# EAGLE schematic 20200724_Main_Board_V2_ForOrdering (EAGLE 7.7.0), part 1 of 2
DATABASE: ./BOM/PartsDB.txt
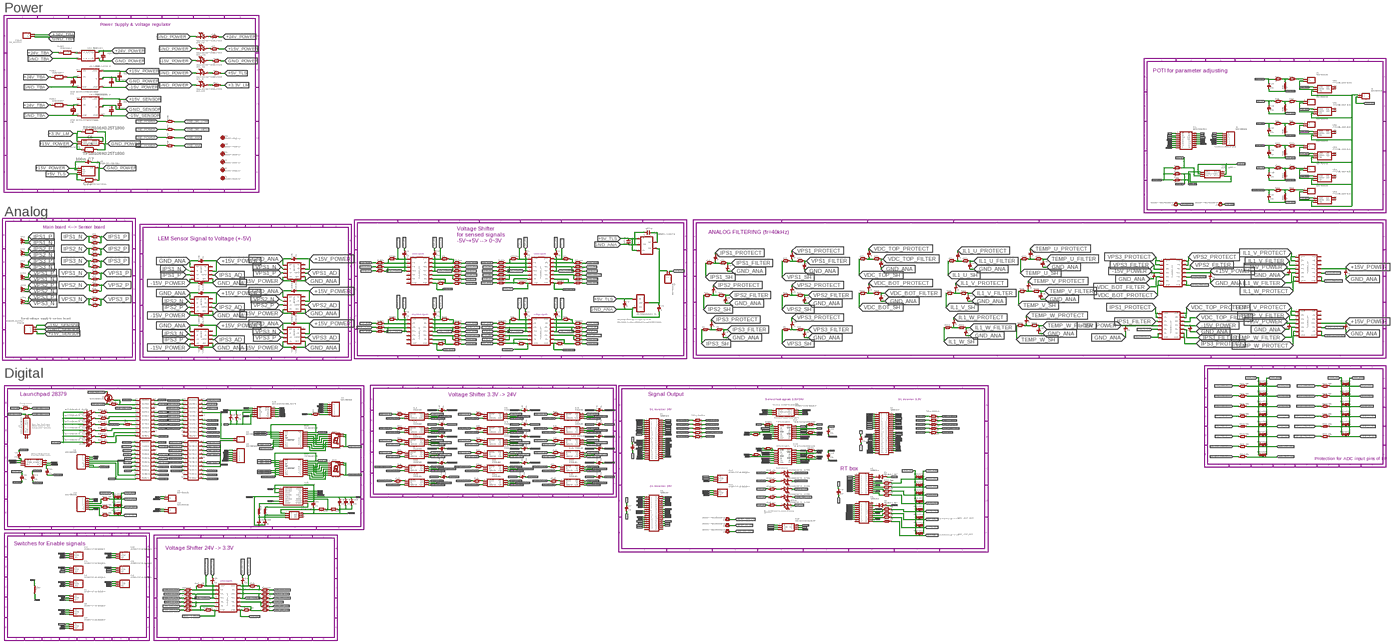
[diagram p0: schematic, sheet 1, overview]
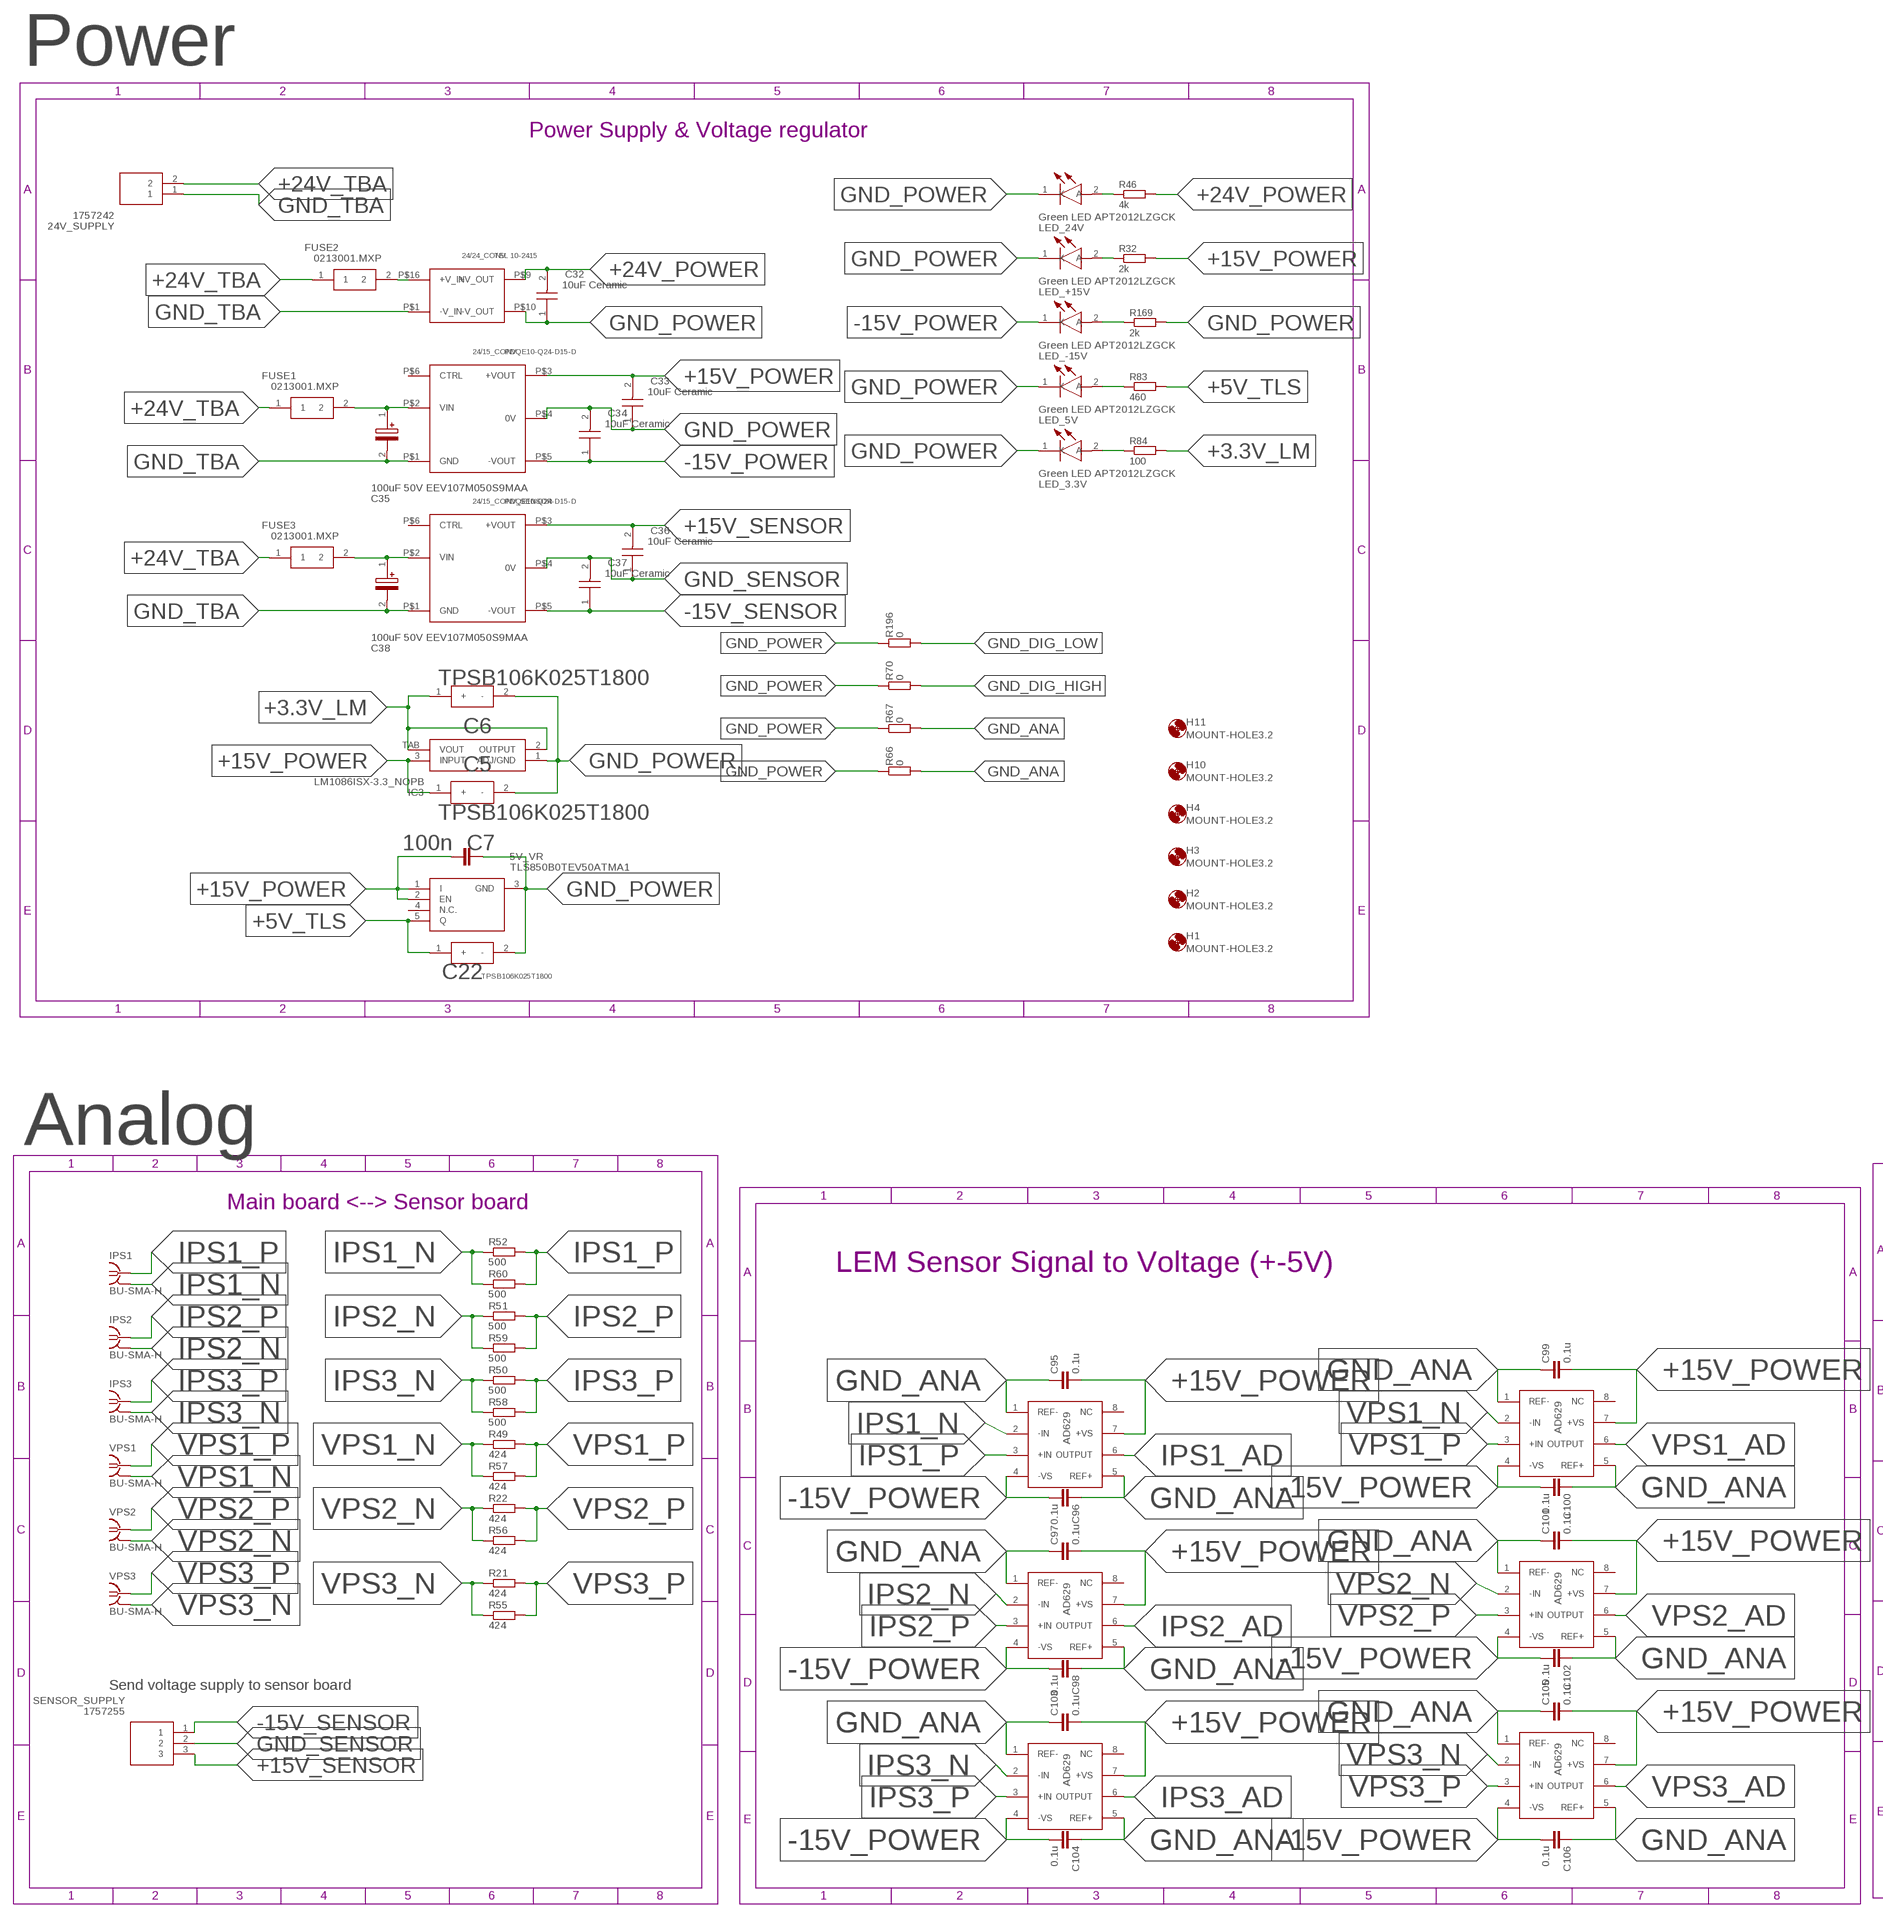
[diagram p1: schematic, sheet 1, part 1 of 9]
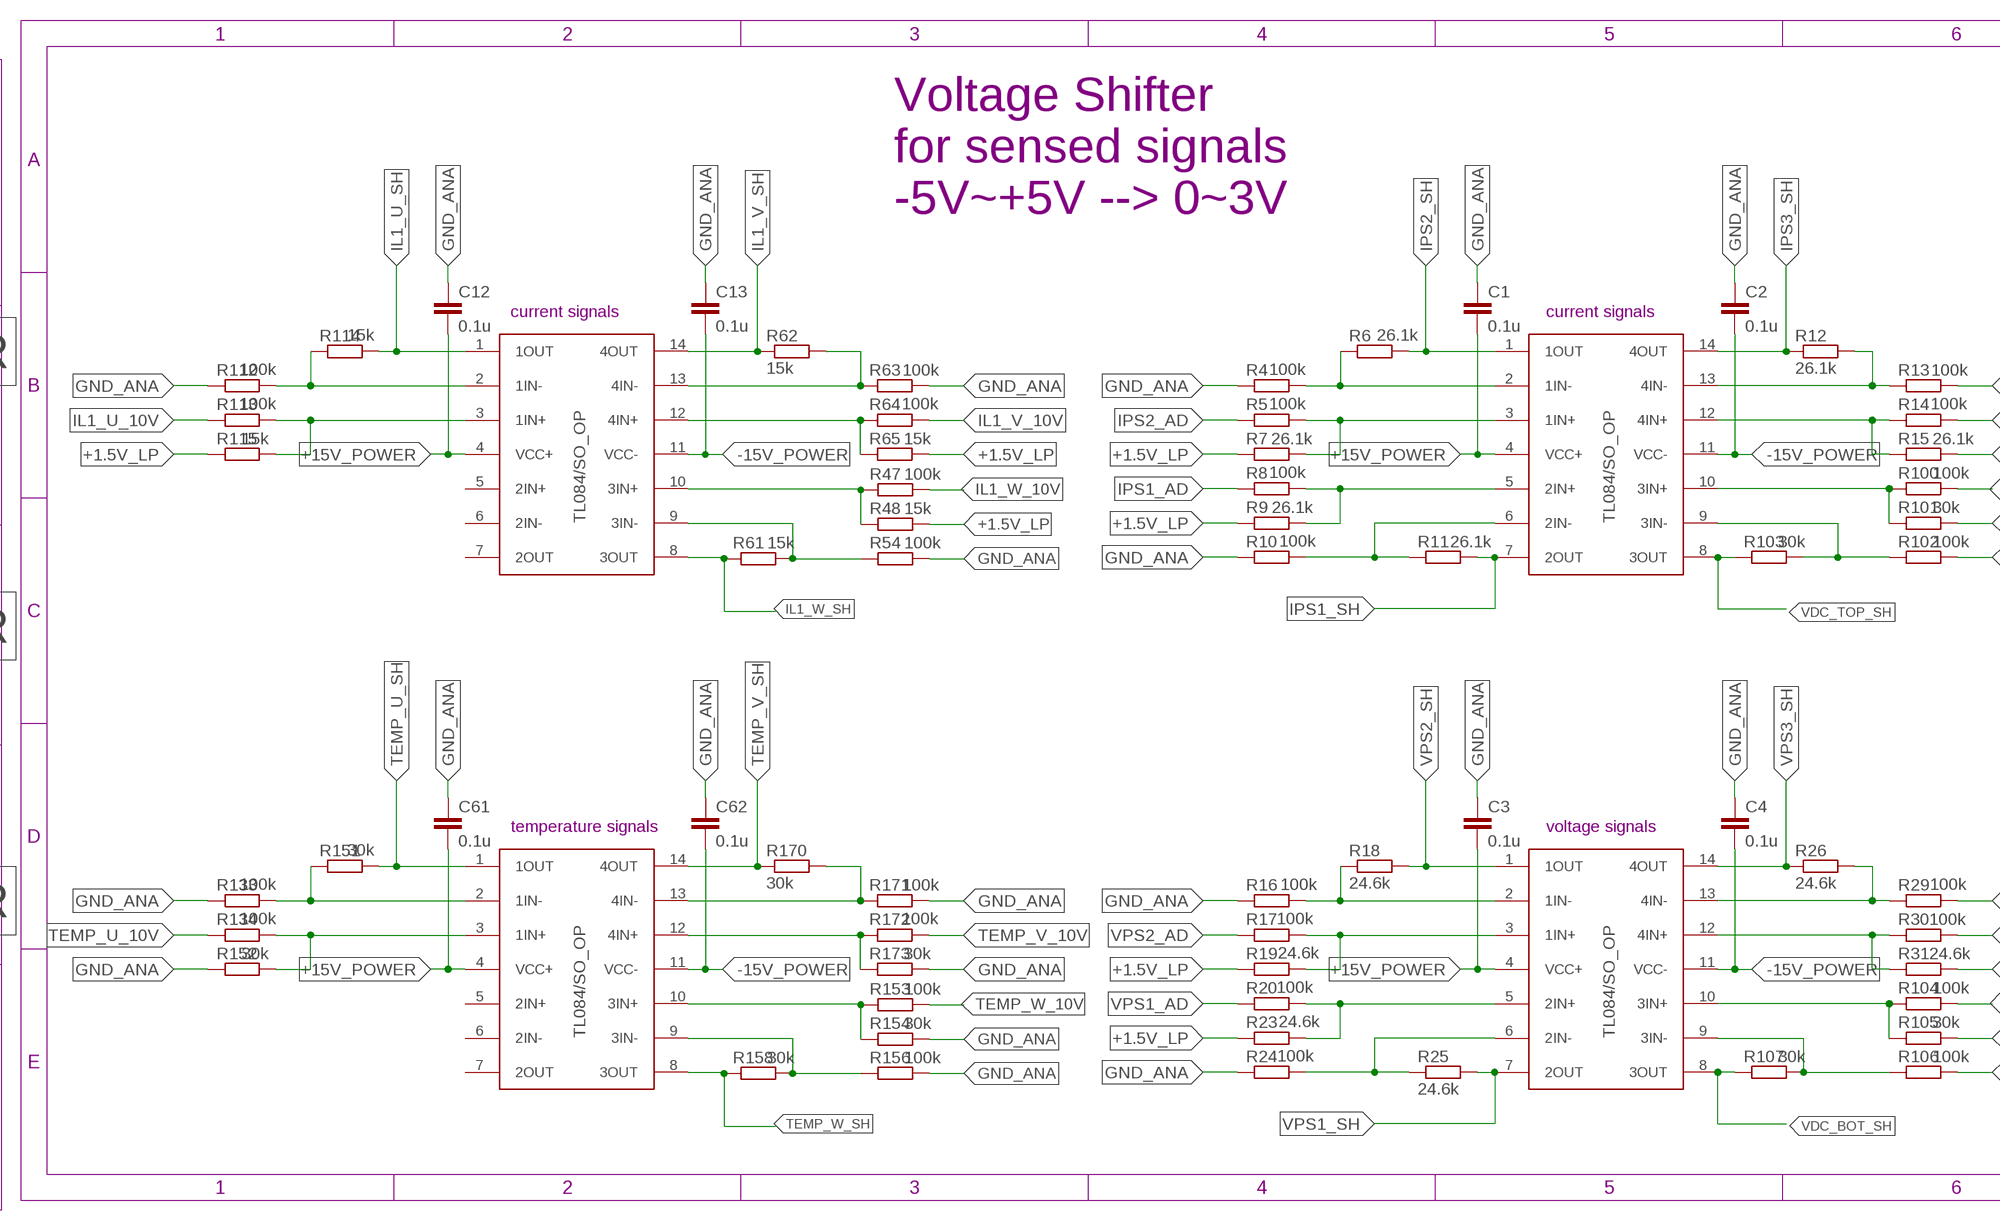
[diagram p2: schematic, sheet 1, part 2 of 9]
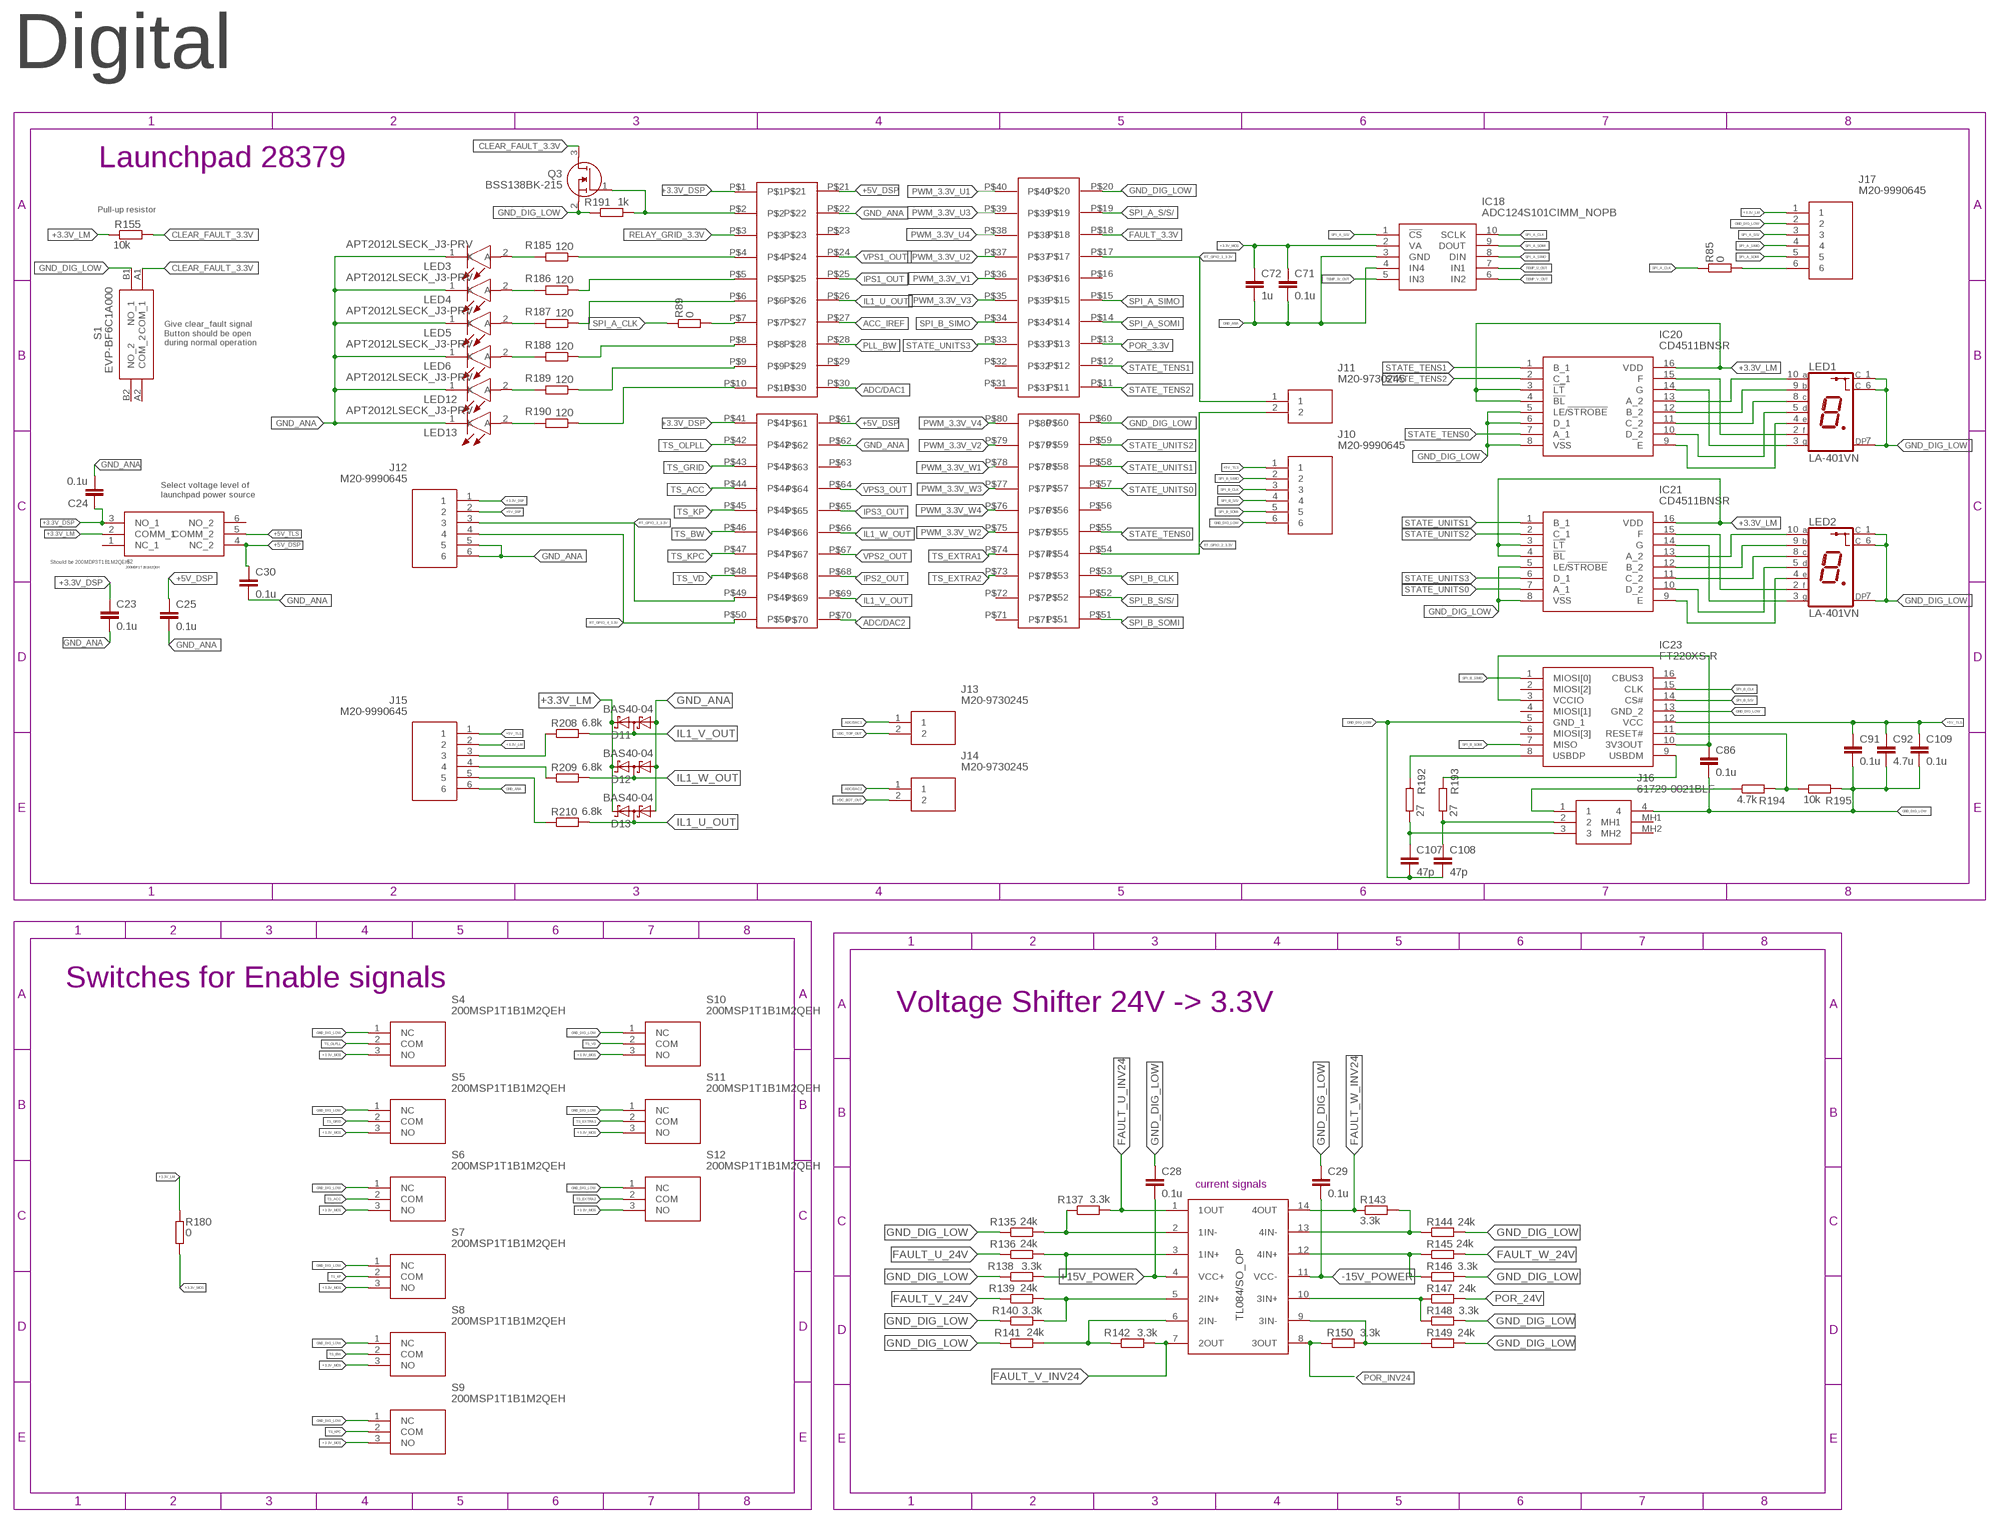
[diagram p3: schematic, sheet 1, part 3 of 9]
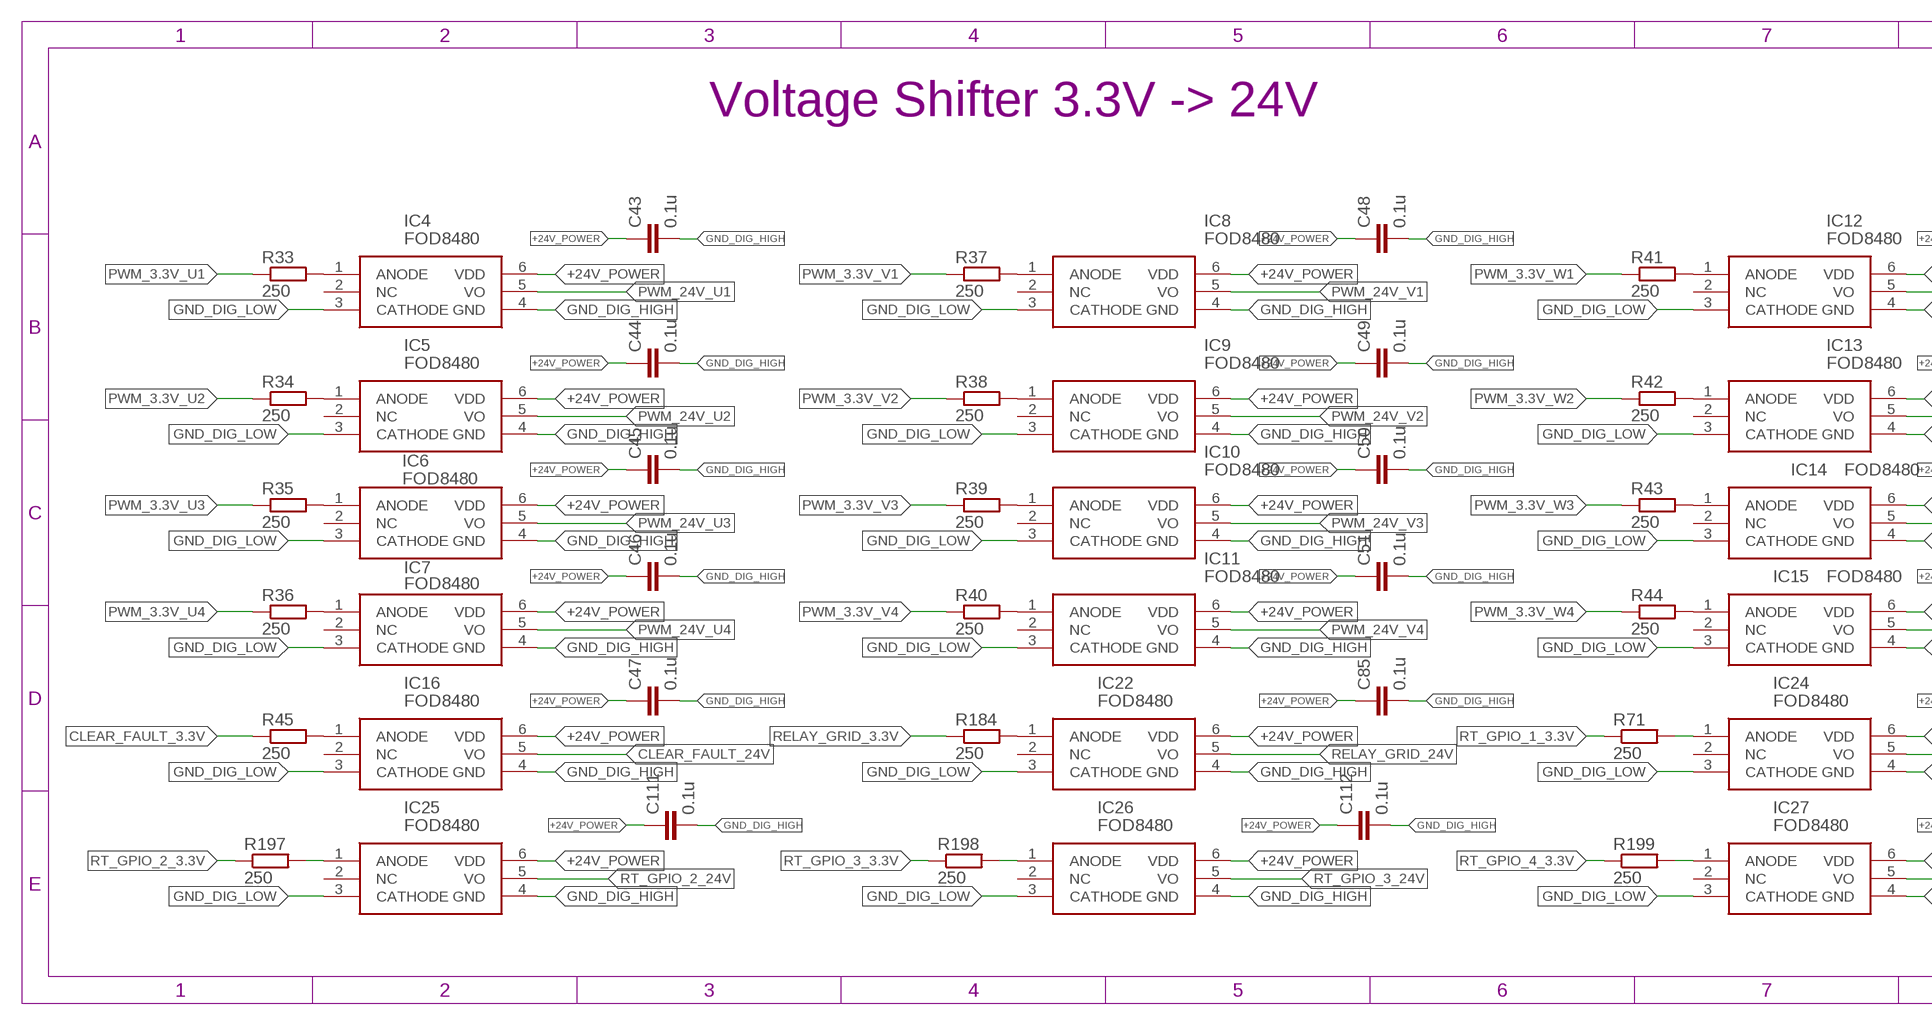
[diagram p4: schematic, sheet 1, part 4 of 9]
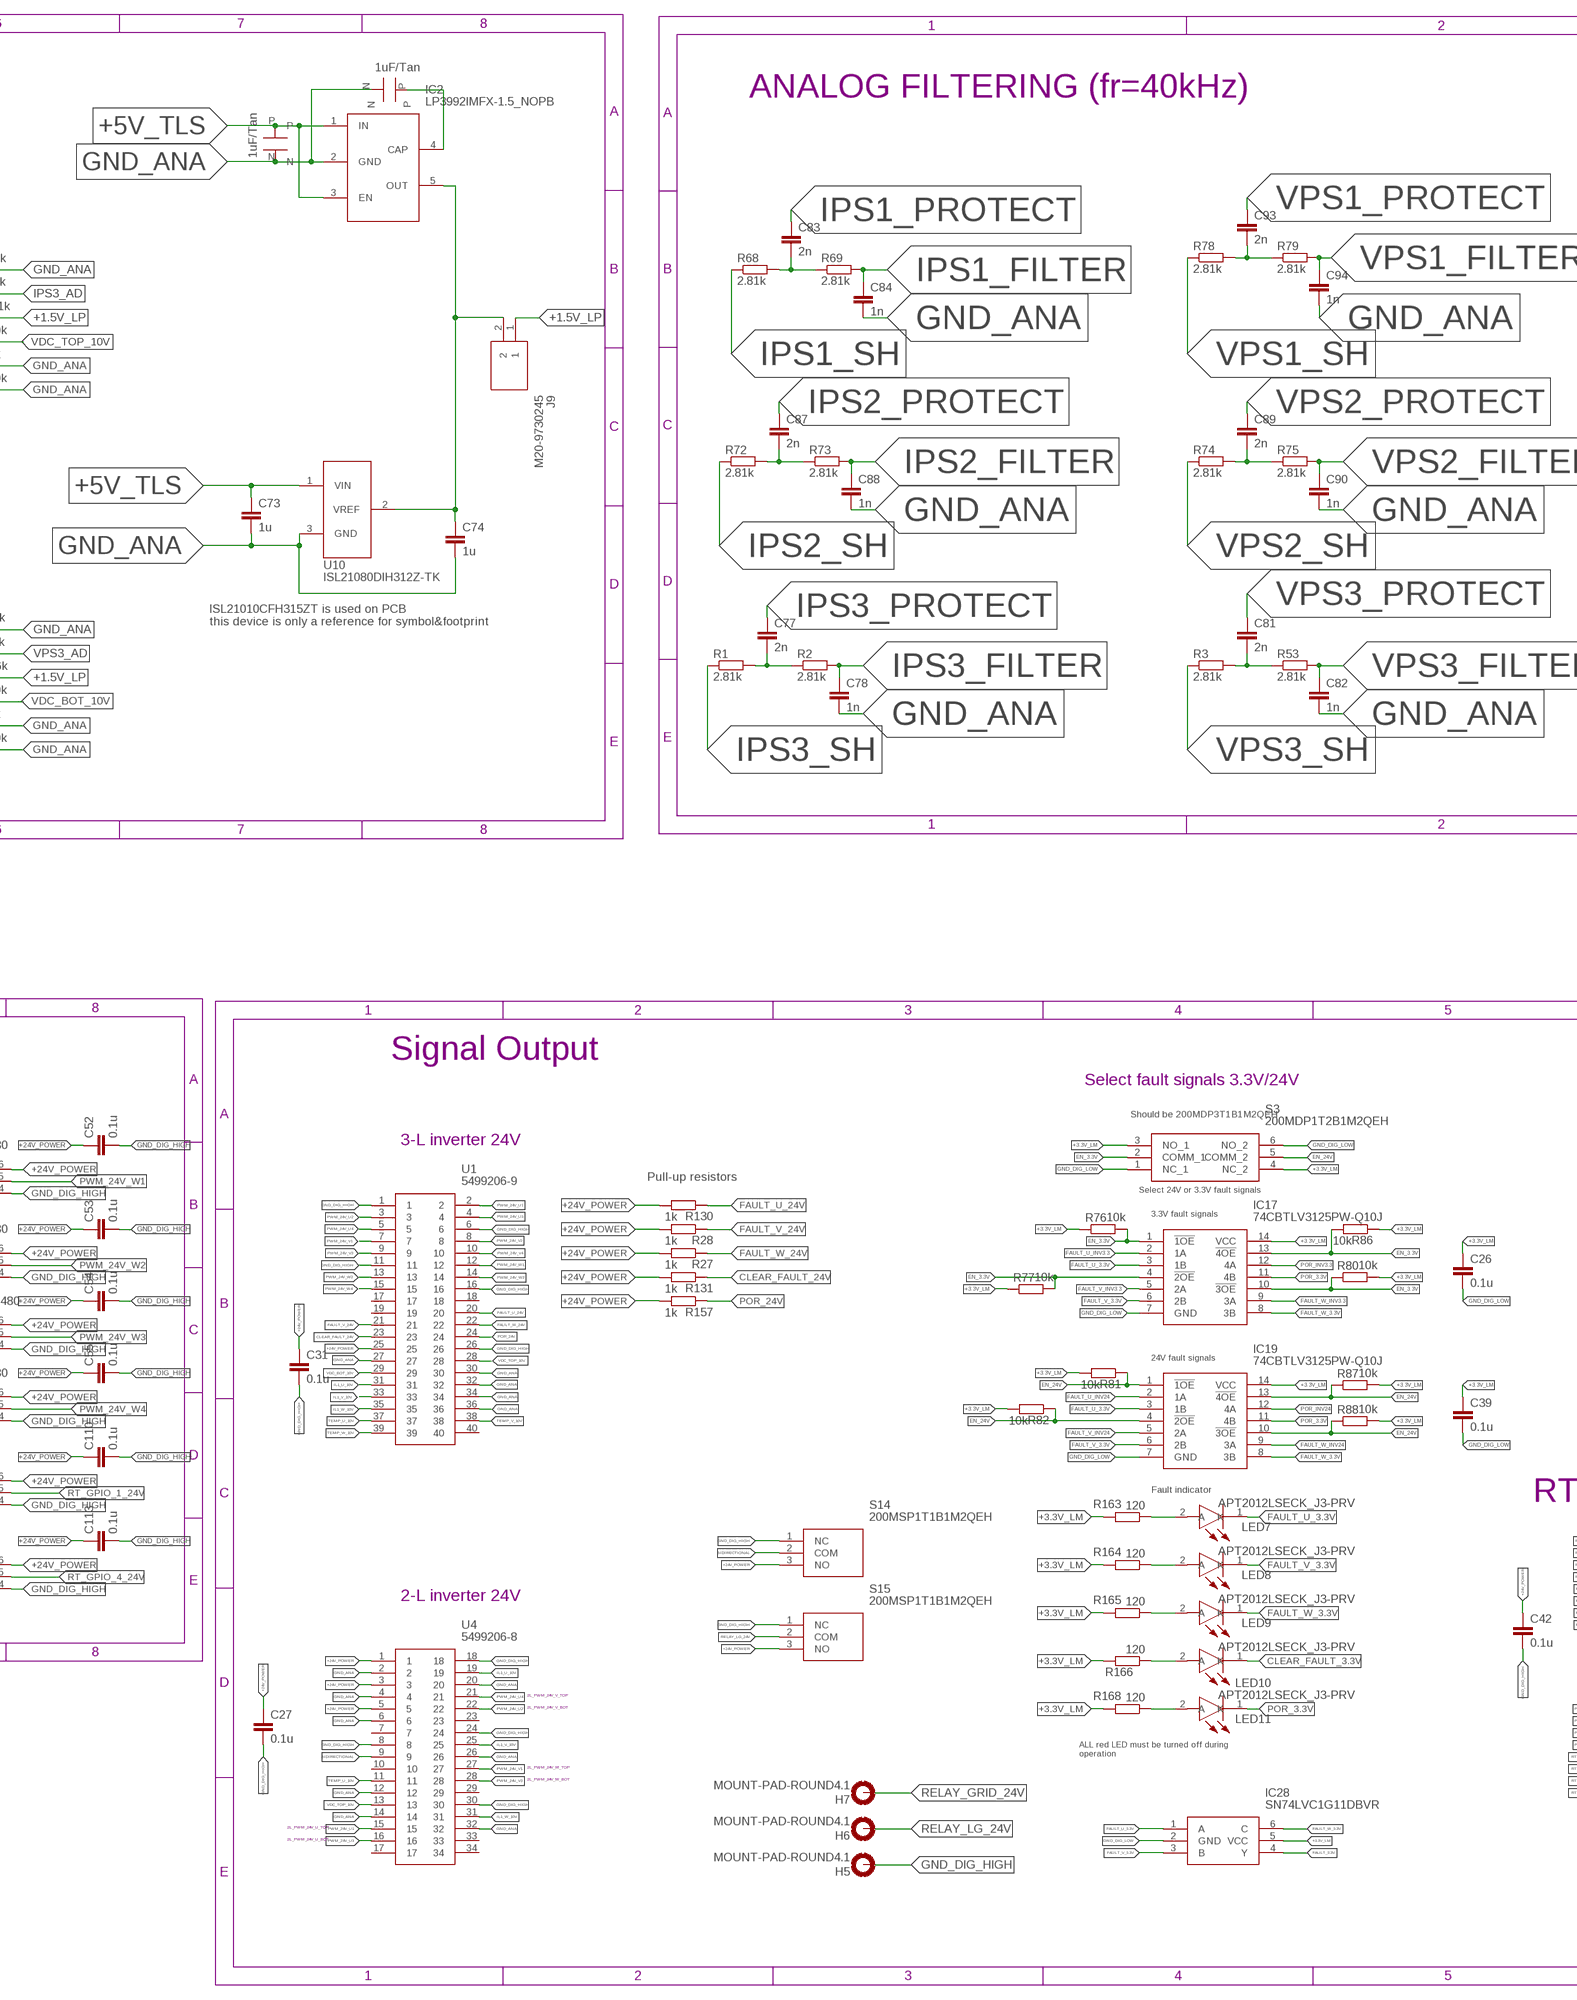
[diagram p5: schematic, sheet 1, part 5 of 9]
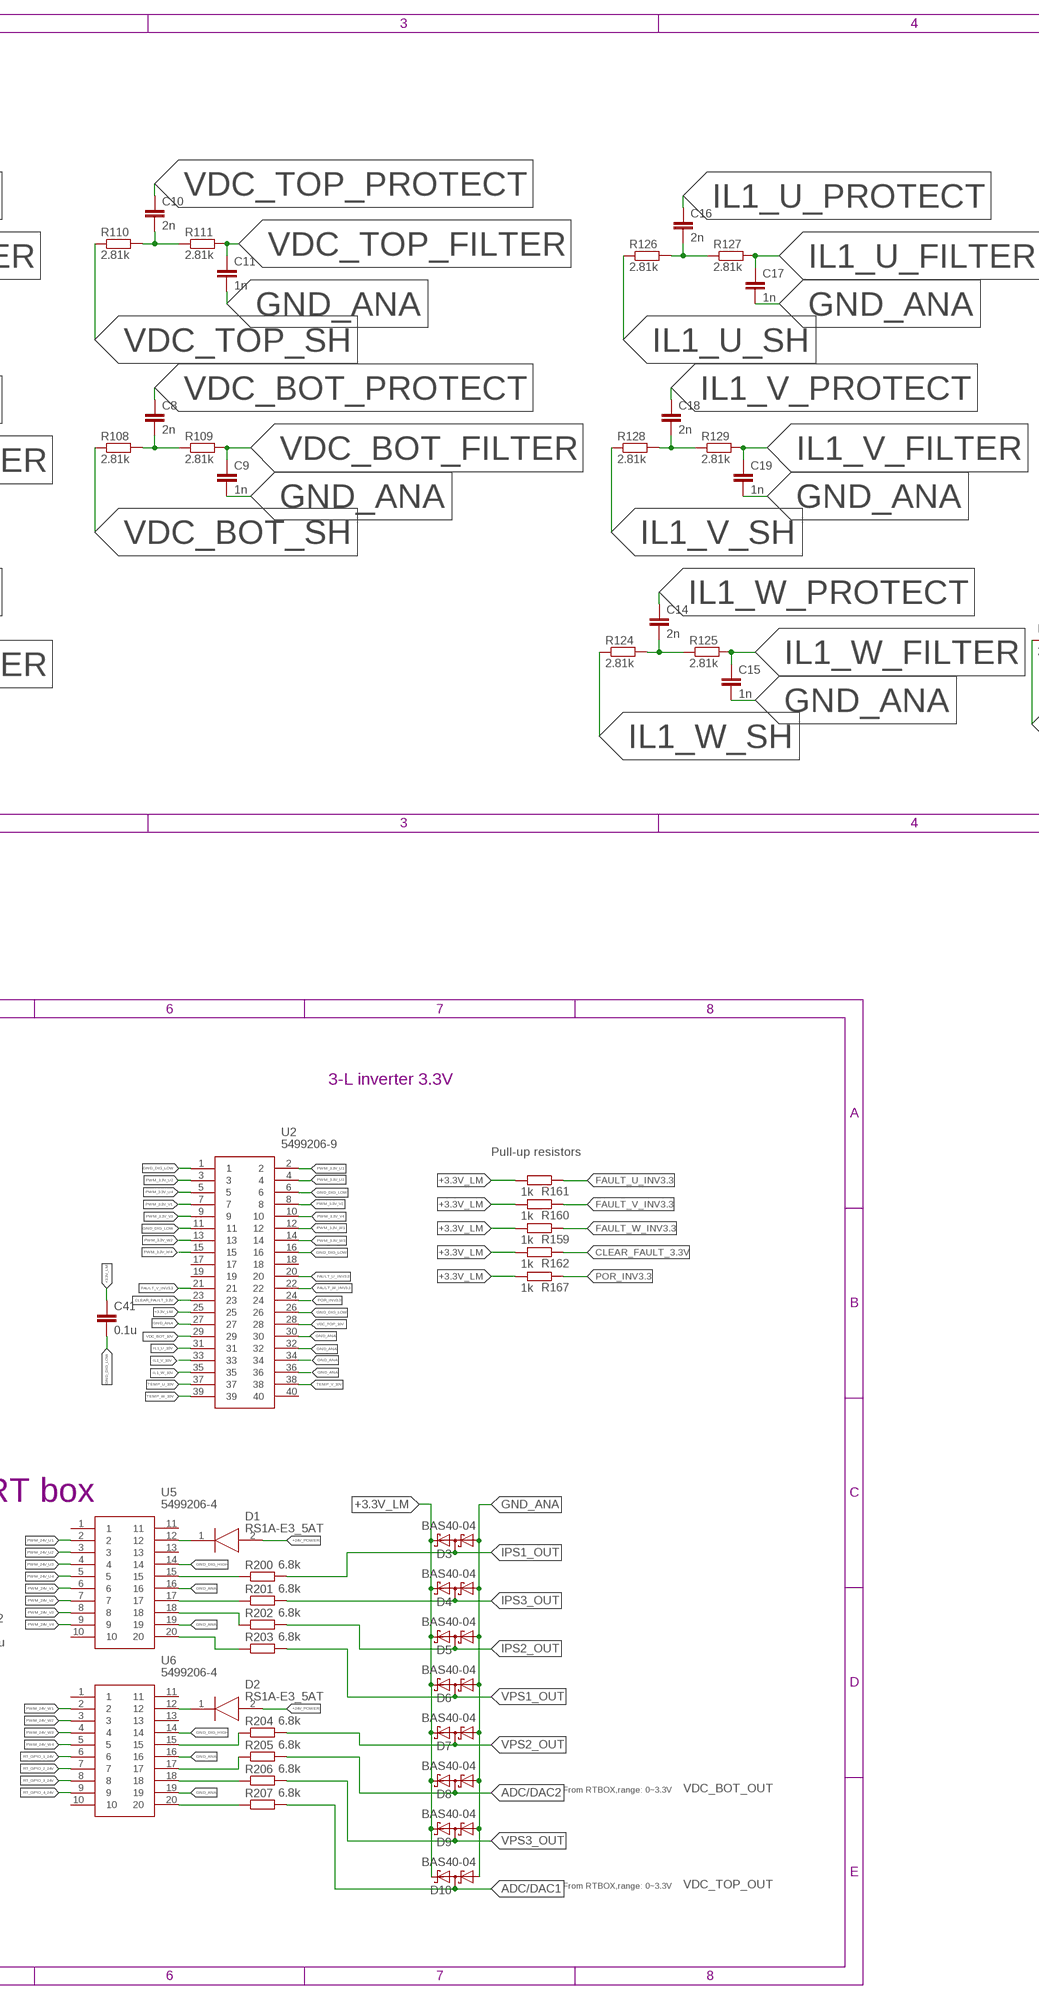
[diagram p6: schematic, sheet 1, part 6 of 9]
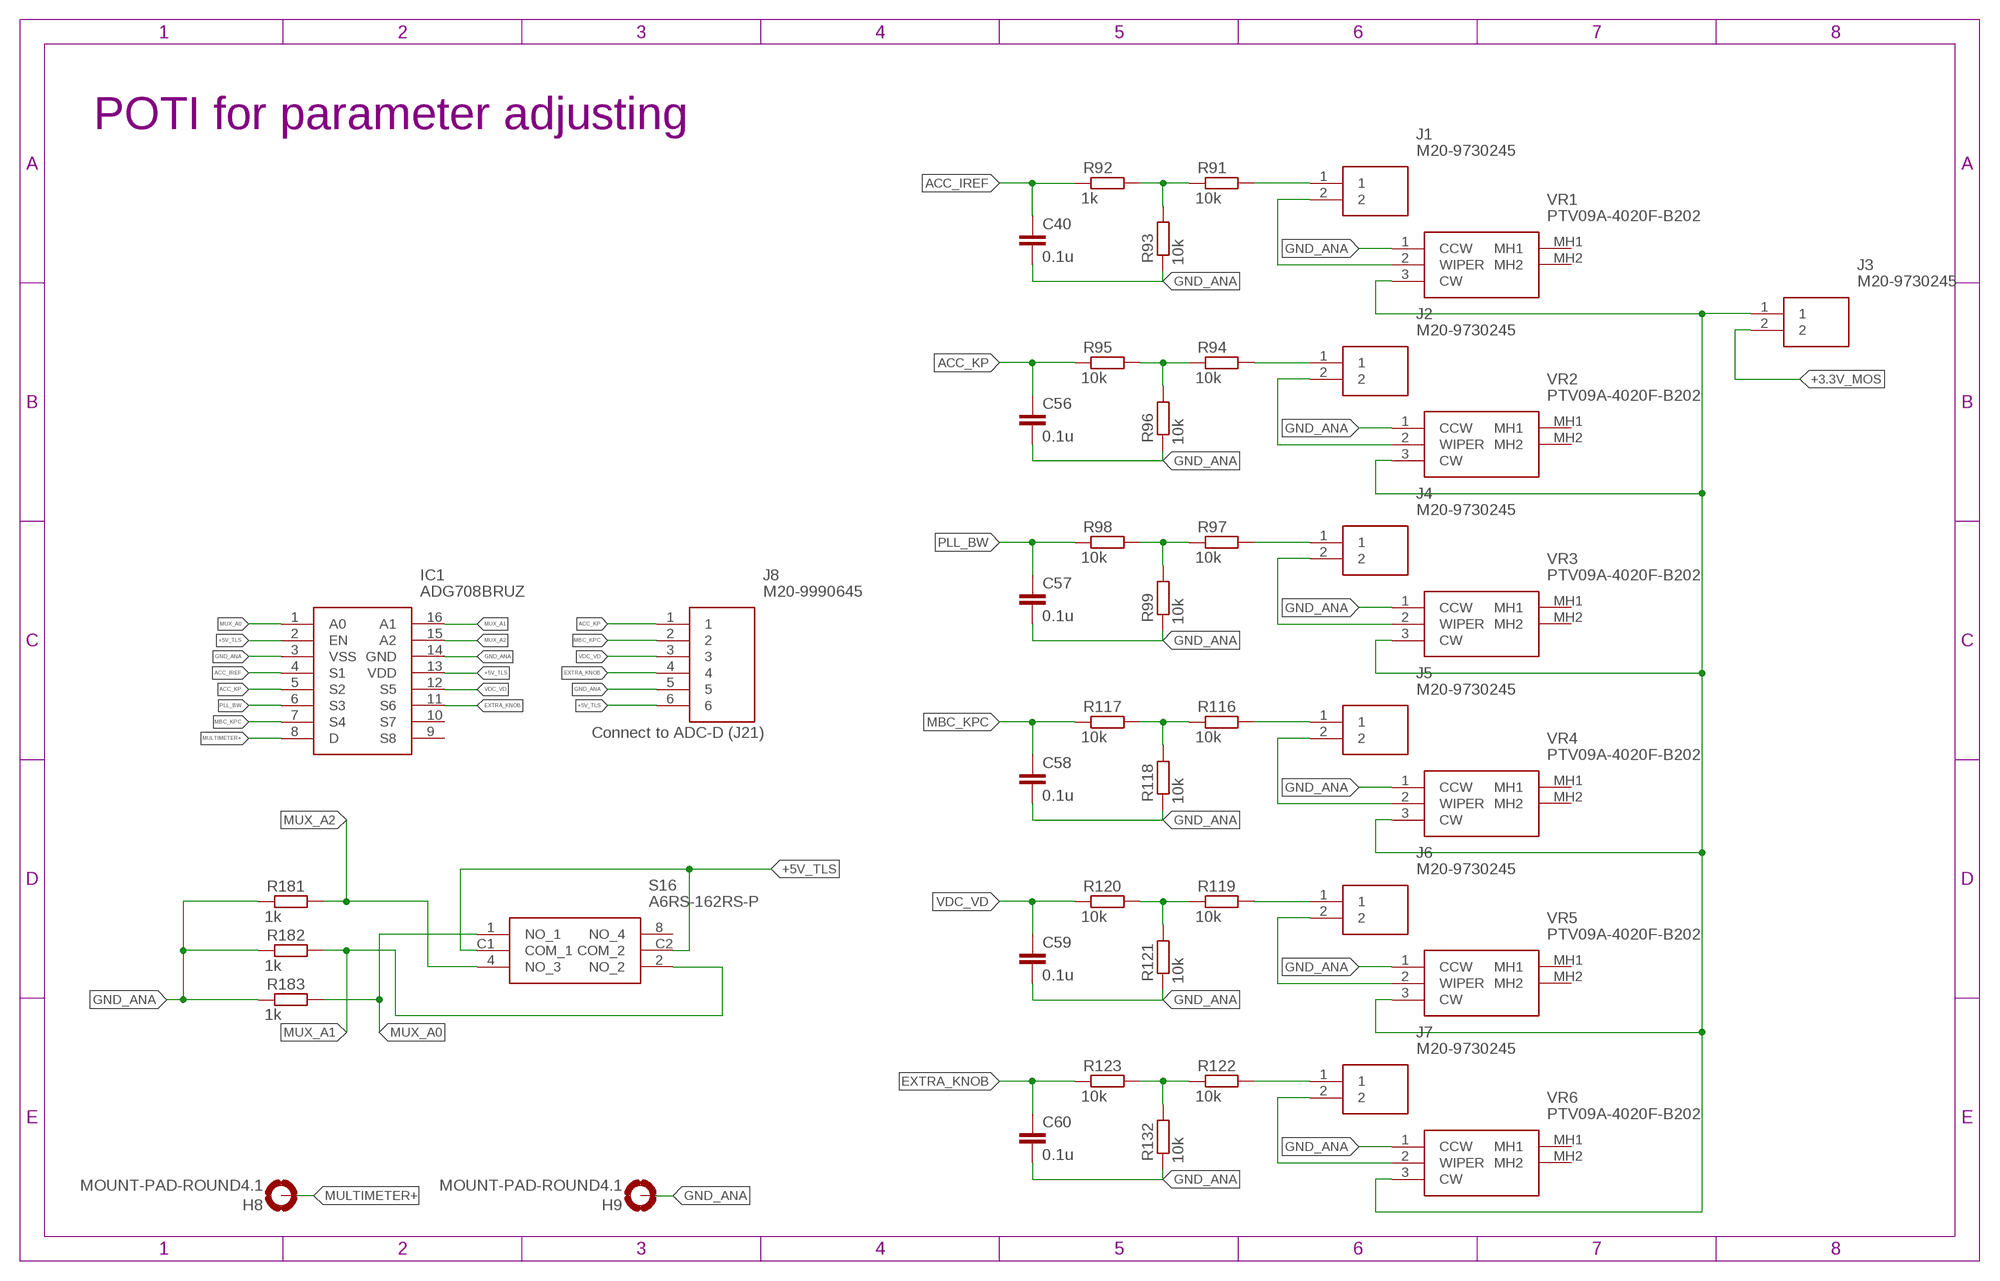
[diagram p7: schematic, sheet 1, part 7 of 9]
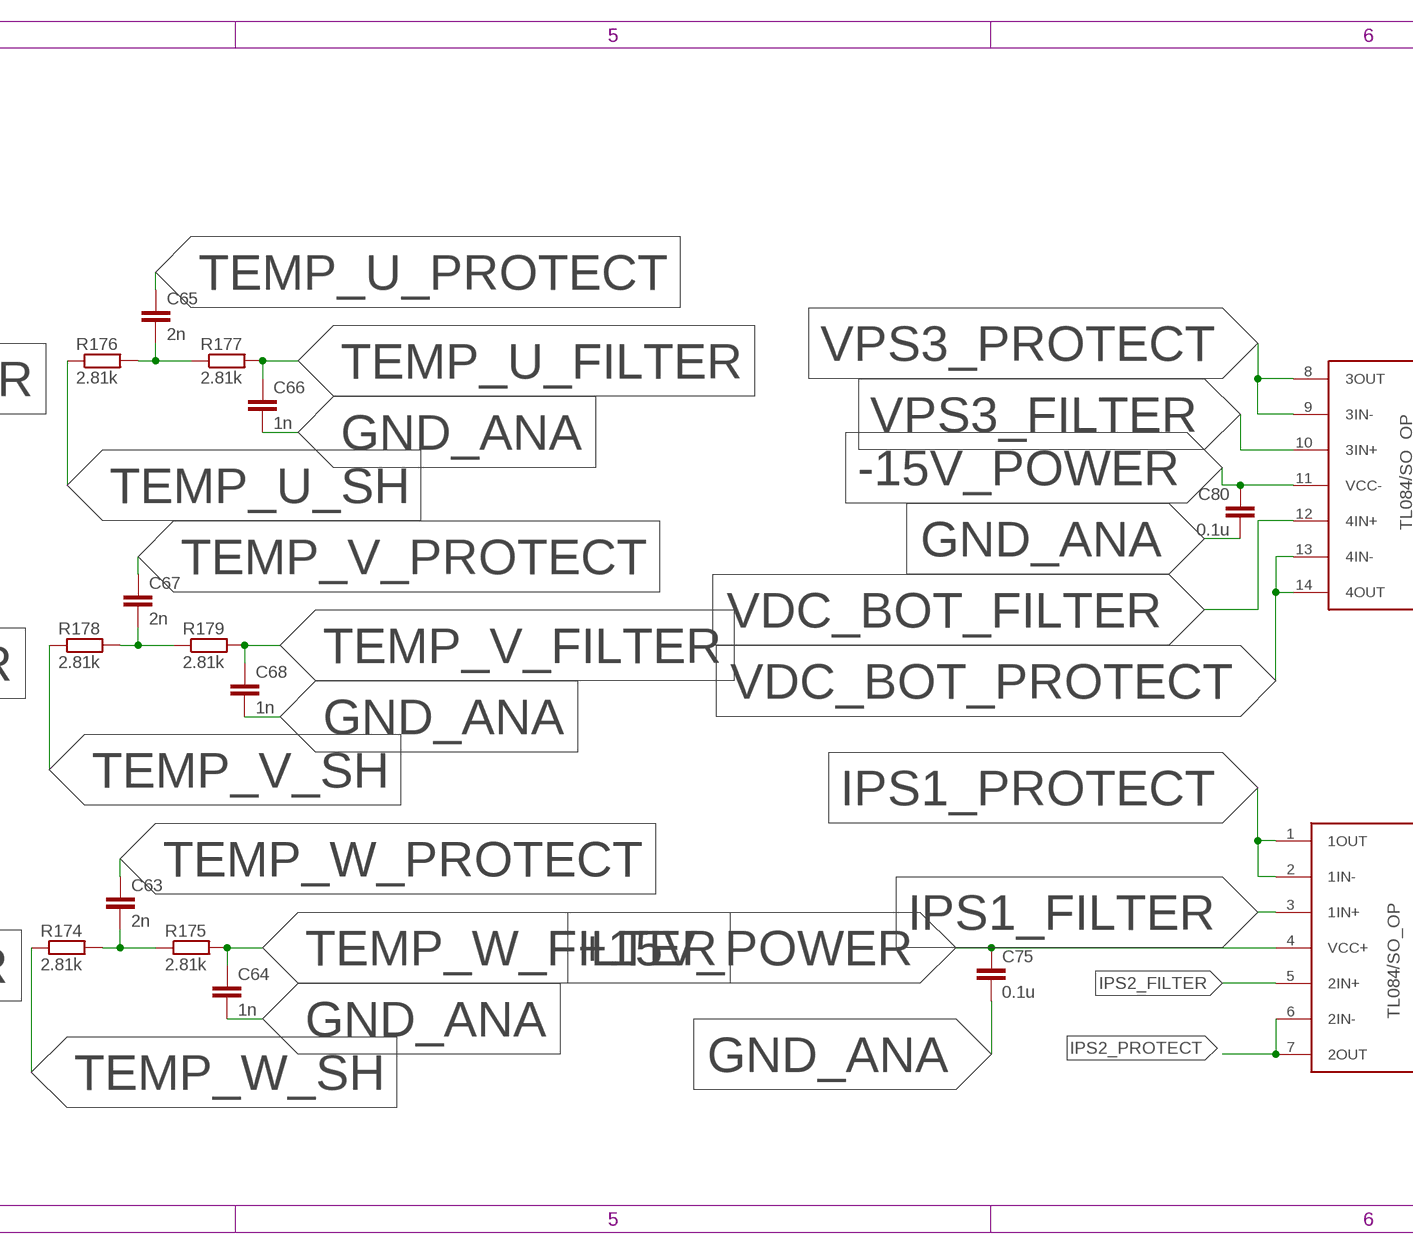
[diagram p8: schematic, sheet 1, part 8 of 9]
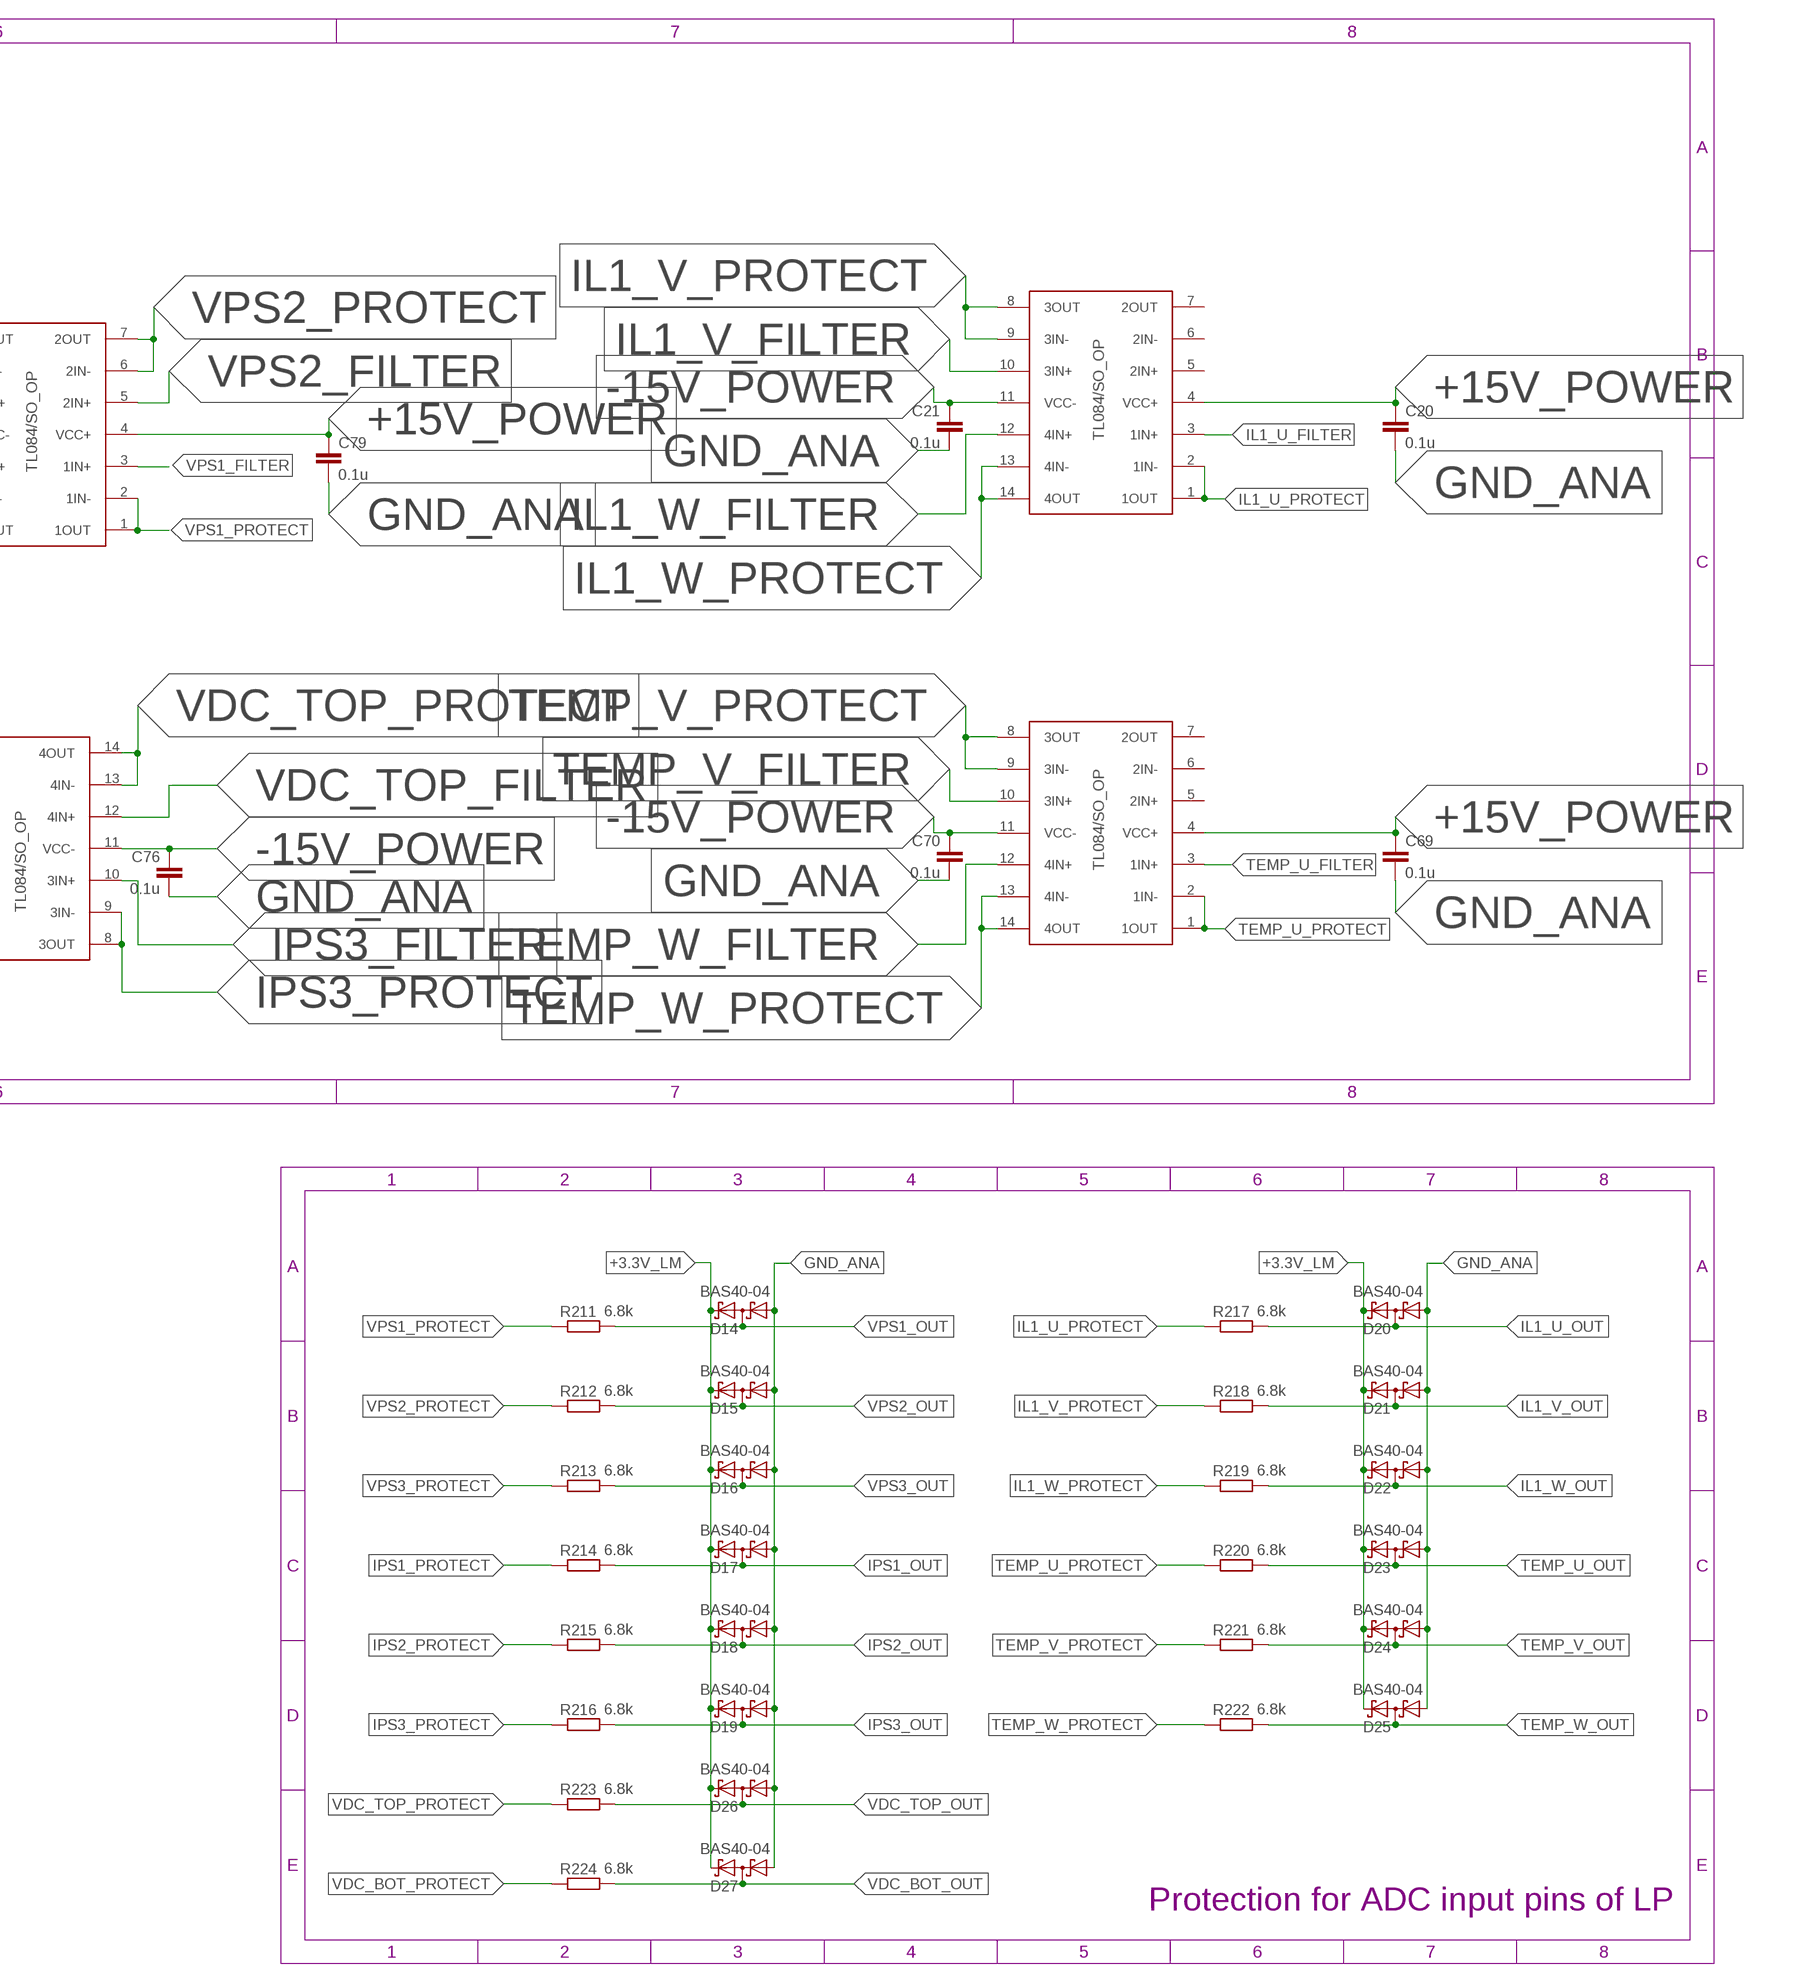
[diagram p9: schematic, sheet 1, part 9 of 9]

## Parts
5V_VR  TLS850B0TEV50ATMA1  [BTS6143D]
24/15_CONV  CUI_24V_15V_DC/DC_CONV  [CUI_24V/15V_DCDC_CONV]
24/15_CONV_SENSOR  CUI_24V_15V_DC/DC_CONV  [CUI_24V/15V_DCDC_CONV]
24/24_CONV  TRACO_24V_24V_DC/DC_CONV  [TRACO_24V/24V_DCDC_CONV]
24V_SUPPLY  1757242  [SHDR2W120P0X508_1X2_1208X1200X]
C1  0.1u  C-EUC0805  [C0805]
C2  0.1u  C-EUC0805  [C0805]
C3  0.1u  C-EUC0805  [C0805]
C4  0.1u  C-EUC0805  [C0805]
C5  TPSB106K025T1800  [DIONM3528X210N]
C6  TPSB106K025T1800  [DIONM3528X210N]
C7  100n  C-EUC0805  [C0805]
C8  2n  C-EUC0805  [C0805]
C9  1n  C-EUC0805  [C0805]
C10  2n  C-EUC0805  [C0805]
C11  1n  C-EUC0805  [C0805]
C12  0.1u  C-EUC0805  [C0805]
C13  0.1u  C-EUC0805  [C0805]
C14  2n  C-EUC0805  [C0805]
C15  1n  C-EUC0805  [C0805]
C16  2n  C-EUC0805  [C0805]
C17  1n  C-EUC0805  [C0805]
C18  2n  C-EUC0805  [C0805]
C19  1n  C-EUC0805  [C0805]
C20  0.1u  C-EUC0805  [C0805]
C21  0.1u  C-EUC0805  [C0805]
C22  TPSB106K025T1800  [DIONM3528X210N]
C23  0.1u  C-EUC0805  [C0805]
C24  0.1u  C-EUC0805  [C0805]
C25  0.1u  C-EUC0805  [C0805]
C26  0.1u  C-EUC0805  [C0805]
C27  0.1u  C-EUC0805  [C0805]
C28  0.1u  C-EUC0805  [C0805]
C29  0.1u  C-EUC0805  [C0805]
C30  0.1u  C-EUC0805  [C0805]
C31  0.1u  C-EUC0805  [C0805]
C32  10uF Ceramic  C3225X7R1N106K250AC  [CAPC3225X230N]
C33  10uF Ceramic  C3225X7R1N106K250AC  [CAPC3225X230N]
C34  10uF Ceramic  C3225X7R1N106K250AC  [CAPC3225X230N]
C35  100uF 50V EEV107M050S9MAA  EEV107M050S9MAA  [CAPAE830X1050N]
C36  10uF Ceramic  C3225X7R1N106K250AC  [CAPC3225X230N]
C37  10uF Ceramic  C3225X7R1N106K250AC  [CAPC3225X230N]
C38  100uF 50V EEV107M050S9MAA  EEV107M050S9MAA  [CAPAE830X1050N]
C39  0.1u  C-EUC0805  [C0805]
C40  0.1u  C-EUC0805  [C0805]
C41  0.1u  C-EUC0805  [C0805]
C42  0.1u  C-EUC0805  [C0805]
C43  0.1u  C-EUC0805  [C0805]
C44  0.1u  C-EUC0805  [C0805]
C45  0.1u  C-EUC0805  [C0805]
C46  0.1u  C-EUC0805  [C0805]
C47  0.1u  C-EUC0805  [C0805]
C48  0.1u  C-EUC0805  [C0805]
C49  0.1u  C-EUC0805  [C0805]
C50  0.1u  C-EUC0805  [C0805]
C51  0.1u  C-EUC0805  [C0805]
C52  0.1u  C-EUC0805  [C0805]
C53  0.1u  C-EUC0805  [C0805]
C54  0.1u  C-EUC0805  [C0805]
C55  0.1u  C-EUC0805  [C0805]
C56  0.1u  C-EUC0805  [C0805]
C57  0.1u  C-EUC0805  [C0805]
C58  0.1u  C-EUC0805  [C0805]
C59  0.1u  C-EUC0805  [C0805]
C60  0.1u  C-EUC0805  [C0805]
C61  0.1u  C-EUC0805  [C0805]
C62  0.1u  C-EUC0805  [C0805]
C63  2n  C-EUC0805  [C0805]
C64  1n  C-EUC0805  [C0805]
C65  2n  C-EUC0805  [C0805]
C66  1n  C-EUC0805  [C0805]
C67  2n  C-EUC0805  [C0805]
C68  1n  C-EUC0805  [C0805]
C69  0.1u  C-EUC0805  [C0805]
C70  0.1u  C-EUC0805  [C0805]
C71  0.1u  C-EUC0805  [C0805]
C72  1u  C-EUC0805  [C0805]
C73  1u  C-EUC0805  [C0805]
C74  1u  C-EUC0805  [C0805]
C75  0.1u  C-EUC0805  [C0805]
C76  0.1u  C-EUC0805  [C0805]
C77  2n  C-EUC0805  [C0805]
C78  1n  C-EUC0805  [C0805]
C79  0.1u  C-EUC0805  [C0805]
C80  0.1u  C-EUC0805  [C0805]
C81  2n  C-EUC0805  [C0805]
C82  1n  C-EUC0805  [C0805]
C83  2n  C-EUC0805  [C0805]
C84  1n  C-EUC0805  [C0805]
C85  0.1u  C-EUC0805  [C0805]
C86  0.1u  C-EUC0805  [C0805]
C87  2n  C-EUC0805  [C0805]
C88  1n  C-EUC0805  [C0805]
C89  2n  C-EUC0805  [C0805]
C90  1n  C-EUC0805  [C0805]
C91  0.1u  C-EUC0805  [C0805]
C92  4.7u  C-EUC0805  [C0805]
C93  2n  C-EUC0805  [C0805]
C94  1n  C-EUC0805  [C0805]
C95  0.1u  C-EUC0805  [C0805]
C96  0.1u  C-EUC0805  [C0805]
C97  0.1u  C-EUC0805  [C0805]
C98  0.1u  C-EUC0805  [C0805]
C99  0.1u  C-EUC0805  [C0805]
C100  0.1u  C-EUC0805  [C0805]
C101  0.1u  C-EUC0805  [C0805]
C102  0.1u  C-EUC0805  [C0805]
C103  0.1u  C-EUC0805  [C0805]
C104  0.1u  C-EUC0805  [C0805]
C105  0.1u  C-EUC0805  [C0805]
C106  0.1u  C-EUC0805  [C0805]
C107  47p  C-EUC0805  [C0805]
C108  47p  C-EUC0805  [C0805]
C109  0.1u  C-EUC0805  [C0805]
C110  0.1u  C-EUC0805  [C0805]
C111  0.1u  C-EUC0805  [C0805]
C112  0.1u  C-EUC0805  [C0805]
C113  0.1u  C-EUC0805  [C0805]
D1  RS1A-E3_5AT  [DIOM5127X229N]
D2  RS1A-E3_5AT  [DIOM5127X229N]
D3  BAS40-04  [SOT23]
D4  BAS40-04  [SOT23]
D5  BAS40-04  [SOT23]
D6  BAS40-04  [SOT23]
D7  BAS40-04  [SOT23]
D8  BAS40-04  [SOT23]
D9  BAS40-04  [SOT23]
D10  BAS40-04  [SOT23]
D11  BAS40-04  [SOT23]
D12  BAS40-04  [SOT23]
D13  BAS40-04  [SOT23]
D14  BAS40-04  [SOT23]
D15  BAS40-04  [SOT23]
D16  BAS40-04  [SOT23]
D17  BAS40-04  [SOT23]
D18  BAS40-04  [SOT23]
D19  BAS40-04  [SOT23]
D20  BAS40-04  [SOT23]
D21  BAS40-04  [SOT23]
D22  BAS40-04  [SOT23]
D23  BAS40-04  [SOT23]
D24  BAS40-04  [SOT23]
D25  BAS40-04  [SOT23]
D26  BAS40-04  [SOT23]
D27  BAS40-04  [SOT23]
FUSE1  0213001.MXP  [RESAD4350W70L2150D550]
FUSE2  0213001.MXP  [RESAD4350W70L2150D550]
FUSE3  0213001.MXP  [RESAD4350W70L2150D550]
H1  MOUNT-HOLE3.2  [3,2]
H2  MOUNT-HOLE3.2  [3,2]
H3  MOUNT-HOLE3.2  [3,2]
H4  MOUNT-HOLE3.2  [3,2]
H5  MOUNT-PAD-ROUND4.1  [4,1-PAD]
H6  MOUNT-PAD-ROUND4.1  [4,1-PAD]
H7  MOUNT-PAD-ROUND4.1  [4,1-PAD]
H8  MOUNT-PAD-ROUND4.1  [4,1-PAD]
H9  MOUNT-PAD-ROUND4.1  [4,1-PAD]
H10  MOUNT-HOLE3.2  [3,2]
H11  MOUNT-HOLE3.2  [3,2]
IC1  ADG708BRUZ  [SOP65P640X120-16N]
IC2  LP3992IMFX-1.5_NOPB  [SOT95P280X145-5N]
IC3  LM1086ISX-3.3_NOPB  [KTT0003B]
IC4  FOD8480  [SOIC127P970X378-6N]
IC5  FOD8480  [SOIC127P970X378-6N]
IC6  FOD8480  [SOIC127P970X378-6N]
IC7  FOD8480  [SOIC127P970X378-6N]
IC8  FOD8480  [SOIC127P970X378-6N]
IC9  FOD8480  [SOIC127P970X378-6N]
IC10  FOD8480  [SOIC127P970X378-6N]
IC11  FOD8480  [SOIC127P970X378-6N]
IC12  FOD8480  [SOIC127P970X378-6N]
IC13  FOD8480  [SOIC127P970X378-6N]
IC14  FOD8480  [SOIC127P970X378-6N]
IC15  FOD8480  [SOIC127P970X378-6N]
IC16  FOD8480  [SOIC127P970X378-6N]
IC17  74CBTLV3125PW-Q10J  [SOP65P640X110-14N]
IC18  ADC124S101CIMM_NOPB  [SOP50P490X110-10N]
IC19  74CBTLV3125PW-Q10J  [SOP65P640X110-14N]
IC20  CD4511BNSR  [SOIC127P780X200-16N]
IC21  CD4511BNSR  [SOIC127P780X200-16N]
IC22  FOD8480  [SOIC127P970X378-6N]
IC23  FT220XS-R  [SOP64P599X175-16N]
IC24  FOD8480  [SOIC127P970X378-6N]
IC25  FOD8480  [SOIC127P970X378-6N]
IC26  FOD8480  [SOIC127P970X378-6N]
IC27  FOD8480  [SOIC127P970X378-6N]
IC28  SN74LVC1G11DBVR  [SOT95P280X145-6N]
IPS1  BU-SMA-H  [BU-SMA-H]
IPS2  BU-SMA-H  [BU-SMA-H]
IPS3  BU-SMA-H  [BU-SMA-H]
J1  M20-9730245  [M209730245]
J2  M20-9730245  [M209730245]
J3  M20-9730245  [M209730245]
J4  M20-9730245  [M209730245]
J5  M20-9730245  [M209730245]
J6  M20-9730245  [M209730245]
J7  M20-9730245  [M209730245]
J8  M20-9990645  [HDRV6W64P0X254_1X6_1524X254X86]
J9  M20-9730245  [M209730245]
J10  M20-9990645  [HDRV6W64P0X254_1X6_1524X254X86]
J11  M20-9730245  [M209730245]
J12  M20-9990645  [HDRV6W64P0X254_1X6_1524X254X86]
J13  M20-9730245  [M209730245]
J14  M20-9730245  [M209730245]
J15  M20-9990645  [HDRV6W64P0X254_1X6_1524X254X86]
J16  61729-0021BLF  [617290021BLF]
J17  M20-9990645  [HDRV6W64P0X254_1X6_1524X254X86]
LED1  LA-401VN  [LA-401]
LED2  LA-401VN  [LA-401]
LED3  APT2012LSECK_J3-PRV  [LEDC2012X75N]
LED4  APT2012LSECK_J3-PRV  [LEDC2012X75N]
LED5  APT2012LSECK_J3-PRV  [LEDC2012X75N]
LED6  APT2012LSECK_J3-PRV  [LEDC2012X75N]
LED7  APT2012LSECK_J3-PRV  [LEDC2012X75N]
LED8  APT2012LSECK_J3-PRV  [LEDC2012X75N]
LED9  APT2012LSECK_J3-PRV  [LEDC2012X75N]
LED10  APT2012LSECK_J3-PRV  [LEDC2012X75N]
LED11  APT2012LSECK_J3-PRV  [LEDC2012X75N]
LED12  APT2012LSECK_J3-PRV  [LEDC2012X75N]
LED13  APT2012LSECK_J3-PRV  [LEDC2012X75N]
LED_3.3V  Green LED APT2012LZGCK  APT2012LZGCK  [LEDC2012X85N]
LED_5V  Green LED APT2012LZGCK  APT2012LZGCK  [LEDC2012X85N]
LED_24V  Green LED APT2012LZGCK  APT2012LZGCK  [LEDC2012X85N]
LED_+15V  Green LED APT2012LZGCK  APT2012LZGCK  [LEDC2012X85N]
LED_-15V  Green LED APT2012LZGCK  APT2012LZGCK  [LEDC2012X85N]
Q3  BSS138BK-215  [SOT95P230X110-3N]
R1  2.81k  R-EU_R0805  [R0805]
R2  2.81k  R-EU_R0805  [R0805]
R3  2.81k  R-EU_R0805  [R0805]
R4  100k  R-EU_R0805  [R0805]
R5  100k  R-EU_R0805  [R0805]
R6  26.1k  R-EU_R0805  [R0805]
R7  26.1k  R-EU_R0805  [R0805]
R8  100k  R-EU_R0805  [R0805]
R9  26.1k  R-EU_R0805  [R0805]
R10  100k  R-EU_R0805  [R0805]
R11  26.1k  R-EU_R0805  [R0805]
R12  26.1k  R-EU_R0805  [R0805]
R13  100k  R-EU_R0805  [R0805]
R14  100k  R-EU_R0805  [R0805]
R15  26.1k  R-EU_R0805  [R0805]
R16  100k  R-EU_R0805  [R0805]
R17  100k  R-EU_R0805  [R0805]
R18  24.6k  R-EU_R0805  [R0805]
R19  24.6k  R-EU_R0805  [R0805]
R20  100k  R-EU_R0805  [R0805]
R21  424  R-EU_R1206  [R1206]
R22  424  R-EU_R1206  [R1206]
R23  24.6k  R-EU_R0805  [R0805]
R24  100k  R-EU_R0805  [R0805]
R25  24.6k  R-EU_R0805  [R0805]
R26  24.6k  R-EU_R0805  [R0805]
R27  1k  R-EU_R0805  [R0805]
R28  1k  R-EU_R0805  [R0805]
R29  100k  R-EU_R0805  [R0805]
R30  100k  R-EU_R0805  [R0805]
R31  24.6k  R-EU_R0805  [R0805]
R32  2k  R-EU_R0805  [R0805]
R33  250  R-EU_R0805  [R0805]
R34  250  R-EU_R0805  [R0805]
R35  250  R-EU_R0805  [R0805]
R36  250  R-EU_R0805  [R0805]
R37  250  R-EU_R0805  [R0805]
R38  250  R-EU_R0805  [R0805]
R39  250  R-EU_R0805  [R0805]
R40  250  R-EU_R0805  [R0805]
R41  250  R-EU_R0805  [R0805]
R42  250  R-EU_R0805  [R0805]
R43  250  R-EU_R0805  [R0805]
R44  250  R-EU_R0805  [R0805]
R45  250  R-EU_R0805  [R0805]
R46  4k  R-EU_R0805  [R0805]
R47  100k  R-EU_R0805  [R0805]
R48  15k  R-EU_R0805  [R0805]
R49  424  R-EU_R1206  [R1206]
R50  500  R-EU_R1206  [R1206]
R51  500  R-EU_R1206  [R1206]
R52  500  R-EU_R1206  [R1206]
R53  2.81k  R-EU_R0805  [R0805]
R54  100k  R-EU_R0805  [R0805]
R55  424  R-EU_R1206  [R1206]
R56  424  R-EU_R1206  [R1206]
R57  424  R-EU_R1206  [R1206]
R58  500  R-EU_R1206  [R1206]
R59  500  R-EU_R1206  [R1206]
R60  500  R-EU_R1206  [R1206]
R61  15k  R-EU_R0805  [R0805]
R62  15k  R-EU_R0805  [R0805]
R63  100k  R-EU_R0805  [R0805]
R64  100k  R-EU_R0805  [R0805]
R65  15k  R-EU_R0805  [R0805]
R66  0  R-EU_R0805  [R0805]
R67  0  R-EU_R0805  [R0805]
R68  2.81k  R-EU_R0805  [R0805]
R69  2.81k  R-EU_R0805  [R0805]
R70  0  R-EU_R0805  [R0805]
R71  250  R-EU_R0805  [R0805]
R72  2.81k  R-EU_R0805  [R0805]
R73  2.81k  R-EU_R0805  [R0805]
R74  2.81k  R-EU_R0805  [R0805]
R75  2.81k  R-EU_R0805  [R0805]
R76  10k  R-EU_R0805  [R0805]
R77  10k  R-EU_R0805  [R0805]
R78  2.81k  R-EU_R0805  [R0805]
R79  2.81k  R-EU_R0805  [R0805]
R80  10k  R-EU_R0805  [R0805]
R81  10k  R-EU_R0805  [R0805]
R82  10k  R-EU_R0805  [R0805]
R83  460  R-EU_R0805  [R0805]
R84  100  R-EU_R0805  [R0805]
R85  0  R-EU_R0805  [R0805]
R86  10k  R-EU_R0805  [R0805]
R87  10k  R-EU_R0805  [R0805]
R88  10k  R-EU_R0805  [R0805]
R89  0  R-EU_R0805  [R0805]
R91  10k  R-EU_R0805  [R0805]
R92  1k  R-EU_R0805  [R0805]
R93  10k  R-EU_R0805  [R0805]
R94  10k  R-EU_R0805  [R0805]
R95  10k  R-EU_R0805  [R0805]
R96  10k  R-EU_R0805  [R0805]
R97  10k  R-EU_R0805  [R0805]
R98  10k  R-EU_R0805  [R0805]
R99  10k  R-EU_R0805  [R0805]
R100  100k  R-EU_R0805  [R0805]
R101  30k  R-EU_R0805  [R0805]
R102  100k  R-EU_R0805  [R0805]
R103  30k  R-EU_R0805  [R0805]
R104  100k  R-EU_R0805  [R0805]
R105  30k  R-EU_R0805  [R0805]
R106  100k  R-EU_R0805  [R0805]
R107  30k  R-EU_R0805  [R0805]
R108  2.81k  R-EU_R0805  [R0805]
R109  2.81k  R-EU_R0805  [R0805]
R110  2.81k  R-EU_R0805  [R0805]
R111  2.81k  R-EU_R0805  [R0805]
R112  100k  R-EU_R0805  [R0805]
R113  100k  R-EU_R0805  [R0805]
R114  15k  R-EU_R0805  [R0805]
R115  15k  R-EU_R0805  [R0805]
R116  10k  R-EU_R0805  [R0805]
R117  10k  R-EU_R0805  [R0805]
R118  10k  R-EU_R0805  [R0805]
R119  10k  R-EU_R0805  [R0805]
R120  10k  R-EU_R0805  [R0805]
R121  10k  R-EU_R0805  [R0805]
R122  10k  R-EU_R0805  [R0805]
R123  10k  R-EU_R0805  [R0805]
R124  2.81k  R-EU_R0805  [R0805]
R125  2.81k  R-EU_R0805  [R0805]
R126  2.81k  R-EU_R0805  [R0805]
R127  2.81k  R-EU_R0805  [R0805]
R128  2.81k  R-EU_R0805  [R0805]
R129  2.81k  R-EU_R0805  [R0805]
R130  1k  R-EU_R0805  [R0805]
R131  1k  R-EU_R0805  [R0805]
R132  10k  R-EU_R0805  [R0805]
R133  100k  R-EU_R0805  [R0805]
R134  100k  R-EU_R0805  [R0805]
R135  24k  R-EU_R0805  [R0805]
R136  24k  R-EU_R0805  [R0805]
R137  3.3k  R-EU_R0805  [R0805]
R138  3.3k  R-EU_R0805  [R0805]
R139  24k  R-EU_R0805  [R0805]
R140  3.3k  R-EU_R0805  [R0805]
R141  24k  R-EU_R0805  [R0805]
R142  3.3k  R-EU_R0805  [R0805]
R143  3.3k  R-EU_R0805  [R0805]
R144  24k  R-EU_R0805  [R0805]
R145  24k  R-EU_R0805  [R0805]
R146  3.3k  R-EU_R0805  [R0805]
R147  24k  R-EU_R0805  [R0805]
R148  3.3k  R-EU_R0805  [R0805]
R149  24k  R-EU_R0805  [R0805]
R150  3.3k  R-EU_R0805  [R0805]
R151  30k  R-EU_R0805  [R0805]
R152  30k  R-EU_R0805  [R0805]
R153  100k  R-EU_R0805  [R0805]
R154  30k  R-EU_R0805  [R0805]
R155  10k  R-EU_R0805  [R0805]
R156  100k  R-EU_R0805  [R0805]
R157  1k  R-EU_R0805  [R0805]
R158  30k  R-EU_R0805  [R0805]
R159  1k  R-EU_R0805  [R0805]
R160  1k  R-EU_R0805  [R0805]
R161  1k  R-EU_R0805  [R0805]
R162  1k  R-EU_R0805  [R0805]
R163  120  R-EU_R0805  [R0805]
R164  120  R-EU_R0805  [R0805]
R165  120  R-EU_R0805  [R0805]
R166  120  R-EU_R0805  [R0805]
R167  1k  R-EU_R0805  [R0805]
R168  120  R-EU_R0805  [R0805]
R169  2k  R-EU_R0805  [R0805]
R170  30k  R-EU_R0805  [R0805]
R171  100k  R-EU_R0805  [R0805]
R172  100k  R-EU_R0805  [R0805]
R173  30k  R-EU_R0805  [R0805]
R174  2.81k  R-EU_R0805  [R0805]
R175  2.81k  R-EU_R0805  [R0805]
R176  2.81k  R-EU_R0805  [R0805]
R177  2.81k  R-EU_R0805  [R0805]
R178  2.81k  R-EU_R0805  [R0805]
R179  2.81k  R-EU_R0805  [R0805]
R180  0  R-EU_R0805  [R0805]
R181  1k  R-EU_R0805  [R0805]
R182  1k  R-EU_R0805  [R0805]
R183  1k  R-EU_R0805  [R0805]
R184  250  R-EU_R0805  [R0805]
R185  120  R-EU_R0805  [R0805]
R186  120  R-EU_R0805  [R0805]
R187  120  R-EU_R0805  [R0805]
R188  120  R-EU_R0805  [R0805]
R189  120  R-EU_R0805  [R0805]
R190  120  R-EU_R0805  [R0805]
R191  1k  R-EU_R0805  [R0805]
R192  27  R-EU_R0805  [R0805]
R193  27  R-EU_R0805  [R0805]
R194  4.7k  R-EU_R0805  [R0805]
R195  10k  R-EU_R0805  [R0805]
R196  0  R-EU_R0805  [R0805]
R197  250  R-EU_R0805  [R0805]
R198  250  R-EU_R0805  [R0805]
R199  250  R-EU_R0805  [R0805]
R200  6.8k  R-EU_R0805  [R0805]
R201  6.8k  R-EU_R0805  [R0805]
R202  6.8k  R-EU_R0805  [R0805]
R203  6.8k  R-EU_R0805  [R0805]
R204  6.8k  R-EU_R0805  [R0805]
R205  6.8k  R-EU_R0805  [R0805]
R206  6.8k  R-EU_R0805  [R0805]
R207  6.8k  R-EU_R0805  [R0805]
R208  6.8k  R-EU_R0805  [R0805]
R209  6.8k  R-EU_R0805  [R0805]
R210  6.8k  R-EU_R0805  [R0805]
R211  6.8k  R-EU_R0805  [R0805]
R212  6.8k  R-EU_R0805  [R0805]
R213  6.8k  R-EU_R0805  [R0805]
R214  6.8k  R-EU_R0805  [R0805]
R215  6.8k  R-EU_R0805  [R0805]
R216  6.8k  R-EU_R0805  [R0805]
R217  6.8k  R-EU_R0805  [R0805]
R218  6.8k  R-EU_R0805  [R0805]
R219  6.8k  R-EU_R0805  [R0805]
R220  6.8k  R-EU_R0805  [R0805]
R221  6.8k  R-EU_R0805  [R0805]
R222  6.8k  R-EU_R0805  [R0805]
R223  6.8k  R-EU_R0805  [R0805]
R224  6.8k  R-EU_R0805  [R0805]
S1  EVP-BF6C1A000  [EVPBF6C1A000]
S2  200MDP1T2B1M2QEH  [200MDP1T2B1M2QEH]
S3  200MDP1T2B1M2QEH  [200MDP1T2B1M2QEH]
S4  200MSP1T1B1M2QEH  [200MSP1T1B1M2QEH]
S5  200MSP1T1B1M2QEH  [200MSP1T1B1M2QEH]
S6  200MSP1T1B1M2QEH  [200MSP1T1B1M2QEH]
S7  200MSP1T1B1M2QEH  [200MSP1T1B1M2QEH]
S8  200MSP1T1B1M2QEH  [200MSP1T1B1M2QEH]
S9  200MSP1T1B1M2QEH  [200MSP1T1B1M2QEH]
S10  200MSP1T1B1M2QEH  [200MSP1T1B1M2QEH]
S11  200MSP1T1B1M2QEH  [200MSP1T1B1M2QEH]
S12  200MSP1T1B1M2QEH  [200MSP1T1B1M2QEH]
S14  200MSP1T1B1M2QEH  [200MSP1T1B1M2QEH]
S15  200MSP1T1B1M2QEH  [200MSP1T1B1M2QEH]
S16  A6RS-162RS-P  [A6RS162RSP]
SENSOR_SUPPLY  1757255  [SHDR3W120P0X508_1X3_1716X1200X]
U1  5499206-9  [TYCO_5499206-9]
U2  5499206-9  [TYCO_5499206-9]
U4  5499206-8  [TYCO_5499206-8]
U5  5499206-4  [TYCO_5499206-4]
U6  5499206-4  [TYCO_5499206-4]
U7  TL084/SO_OPONLINE  [TL084/SO_OP_LIB]
U10  ISL21080DIH312Z-TK  [SOT23-3]
U13  TL084/SO_OPONLINE  [TL084/SO_OP_LIB]
U$1  TL084/SO_OPONLINE  [TL084/SO_OP_LIB]
U$2  TL084/SO_OPONLINE  [TL084/SO_OP_LIB]
U$3  TL084/SO_OPONLINE  [TL084/SO_OP_LIB]
U$4  TL084/SO_OPONLINE  [TL084/SO_OP_LIB]
U$6  TL084/SO_OPONLINE  [TL084/SO_OP_LIB]
U$8  TL084/SO_OPONLINE  [TL084/SO_OP_LIB]
U$9  TANTALUM_C_1UF_KEMTANTALUM_C_1UF_KEM  [TANTALUM_C_1UF_KEM]
U$10  TANTALUM_C_1UF_KEMTANTALUM_C_1UF_KEM  [TANTALUM_C_1UF_KEM]
U$13  LAUNCHPAD  [LAUNCHPAD28379]
U$15  TL084/SO_OPONLINE  [TL084/SO_OP_LIB]
U$24  AD629_DIFFAONLINE  [AD629_DIFFA_LIB]
U$27  AD629_DIFFAONLINE  [AD629_DIFFA_LIB]
U$28  AD629_DIFFAONLINE  [AD629_DIFFA_LIB]
U$29  AD629_DIFFAONLINE  [AD629_DIFFA_LIB]
U$30  AD629_DIFFAONLINE  [AD629_DIFFA_LIB]
U$31  AD629_DIFFAONLINE  [AD629_DIFFA_LIB]
VPS1  BU-SMA-H  [BU-SMA-H]
VPS2  BU-SMA-H  [BU-SMA-H]
VPS3  BU-SMA-H  [BU-SMA-H]
VR1  PTV09A-4020F-B202  [PTV09A4020FB503]
VR2  PTV09A-4020F-B202  [PTV09A4020FB503]
VR3  PTV09A-4020F-B202  [PTV09A4020FB503]
VR4  PTV09A-4020F-B202  [PTV09A4020FB503]
VR5  PTV09A-4020F-B202  [PTV09A4020FB503]
VR6  PTV09A-4020F-B202  [PTV09A4020FB503]

## Nets
+1.5V_LP: J9.1 R7.1 R9.1 R15.2 R19.1 R23.1 R31.2 R48.2 R65.2 R115.1
+3.3V_DSP: C23.1 C24.1 J12.1 S2.3(NO_1) U$13.P$1 U$13.P$41
+3.3V_LM: C6.1(+) C26.1 C39.1 C41.1 D3.2(C2) D4.2(C2) D5.2(C2) D6.2(C2) D7.2(C2) D8.2(C2) D9.2(C2) D10.2(C2) D11.2(C2) D12.2(C2) D13.2(C2) D14.2(C2) D15.2(C2) D16.2(C2) D17.2(C2) D18.2(C2) D19.2(C2) D20.2(C2) D21.2(C2) D22.2(C2) D23.2(C2) D24.2(C2) D25.2(C2) D26.2(C2) D27.2(C2) IC3.2(OUTPUT) IC3.TAB(VOUT) IC17.14(VCC) IC19.14(VCC) IC20.3(!LT) IC20.4(!BL) IC20.16(VDD) IC21.3(!LT) IC21.4(!BL) IC21.16(VDD) IC28.5(VCC) J15.2 J17.1 R76.1 R77.1 R80.2 R81.2 R82.2 R84.2 R86.1 R87.2 R88.2 R155.1 R159.2 R160.2 R161.2 R162.2 R163.2 R164.2 R165.2 R166.2 R167.2 R168.2 R180.1 S2.2(COMM_1) S3.3(NO_1) S3.4(NC_2) U2.25
+3.3V_MOS: C71.1 C72.1 IC18.2(VA) J3.2 R180.2 S4.3(NO) S5.3(NO) S6.3(NO) S7.3(NO) S8.3(NO) S9.3(NO) S10.3(NO) S11.3(NO) S12.3(NO)
+5V_DSP: C25.1 C30.1 J12.2 S2.4(NC_2) U$13.P$21 U$13.P$61
+5V_TLS: 5V_VR.5(Q) C22.1(+) C73.1 C91.1 C92.1 C109.1 IC1.2(EN) IC1.13(VDD) IC2.1(IN) IC2.3(EN) IC23.12(VCC) J8.6 J10.1 J15.1 R83.2 S2.5(COMM_2) S16.C1(COM_1) S16.C2(COM_2) U10.1(VIN) U$9.P
+15V_POWER: 5V_VR.1(I) 5V_VR.2(EN) 24/15_CONV.P$3(+VOUT) C1.2 C3.2 C5.1(+) C7.2 C12.2 C20.1 C28.2 C33.2 C61.2 C69.1 C75.1 C79.1 C95.2 C97.2 C99.2 C101.2 C103.2 C105.2 IC3.3(INPUT) R32.2 U7.4(VCC+) U13.4(VCC+) U$1.4(VCC+) U$2.4(VCC+) U$3.4(VCC+) U$4.4(VCC+) U$6.4(VCC+) U$8.4(VCC+) U$15.4(VCC+) U$24.7(+VS) U$27.7(+VS) U$28.7(+VS) U$29.7(+VS) U$30.7(+VS) U$31.7(+VS)
+15V_SENSOR: 24/15_CONV_SENSOR.P$3(+VOUT) C36.2 SENSOR_SUPPLY.3
+24V_POWER: 24/24_CONV.P$9(+V_OUT) C27.1 C31.1 C32.2 C42.1 C43.1 C44.1 C45.1 C46.1 C47.1 C48.1 C49.1 C50.1 C51.1 C52.1 C53.1 C54.1 C55.1 C85.1 C110.1 C111.1 C112.1 C113.1 D1.2(A) D2.2(A) IC4.6(VDD) IC5.6(VDD) IC6.6(VDD) IC7.6(VDD) IC8.6(VDD) IC9.6(VDD) IC10.6(VDD) IC11.6(VDD) IC12.6(VDD) IC13.6(VDD) IC14.6(VDD) IC15.6(VDD) IC16.6(VDD) IC22.6(VDD) IC24.6(VDD) IC25.6(VDD) IC26.6(VDD) IC27.6(VDD) R27.2 R28.2 R46.2 R130.2 R131.2 R157.2 S14.3(NO) S15.3(NO) U1.25 U4.1 U4.3 U4.5
+24V_TBA: 24V_SUPPLY.2 FUSE1.1 FUSE2.1 FUSE3.1
-15V_POWER: 24/15_CONV.P$5(-VOUT) C2.2 C4.2 C13.2 C21.1 C29.2 C34.1 C62.2 C70.1 C76.1 C80.1 C96.2 C98.2 C100.2 C102.2 C104.2 C106.2 LED_-15V.1(K) U7.11(VCC-) U13.11(VCC-) U$1.11(VCC-) U$2.11(VCC-) U$3.11(VCC-) U$4.11(VCC-) U$6.11(VCC-) U$8.11(VCC-) U$15.11(VCC-) U$24.4(-VS) U$27.4(-VS) U$28.4(-VS) U$29.4(-VS) U$30.4(-VS) U$31.4(-VS)
-15V_SENSOR: 24/15_CONV_SENSOR.P$5(-VOUT) C37.1 SENSOR_SUPPLY.1
ACC_IREF: C40.1 IC1.4(S1) R92.1 U$13.P$27
ACC_KP: C56.1 IC1.5(S2) J8.1 R95.1
ADC/DAC1: D10.3(C1A2) J13.1 R207.2 U$13.P$30
ADC/DAC2: D8.3(C1A2) J14.1 R205.2 U$13.P$70
BIDIRECTIONAL: S14.2(COM) U4.9
CLEAR_FAULT_3.3V: LED10.1(K) Q3.3(D) R45.1 R155.2 R162.1 S1.A1(COM_1) U2.23
CLEAR_FAULT_24V: IC16.5(VO) R131.1 U1.23
EN_3.3V: IC17.1(!1OE) IC17.4(!2OE) IC17.10(!3OE) IC17.13(!4OE) R76.2 R77.2 R80.1 R86.2 S3.2(COMM_1)
EN_24V: IC19.1(!1OE) IC19.4(!2OE) IC19.10(!3OE) IC19.13(!4OE) R81.1 R82.1 R87.1 R88.1 S3.5(COMM_2)
EXTRA_KNOB: C60.1 IC1.11(S6) J8.4 R123.1
FAULT_3.3V: IC28.4(Y) U$13.P$18
FAULT_U_3.3V: IC17.3(1B) IC19.3(1B) IC28.1(A) LED7.1(K)
FAULT_U_24V: R130.1 R136.1 U1.20
FAULT_U_INV3.3: IC17.2(1A) R161.1 U2.20
FAULT_U_INV24: IC19.2(1A) R137.2 U$8.1(1OUT)
FAULT_V_3.3V: IC17.6(2B) IC19.6(2B) IC28.3(B) LED8.1(K)
FAULT_V_24V: R28.1 R139.1 U1.21
FAULT_V_INV3.3: IC17.5(2A) R160.1 U2.21
FAULT_V_INV24: IC19.5(2A) R142.2 U$8.7(2OUT)
FAULT_W_3.3V: IC17.8(3B) IC19.8(3B) IC28.6(C) LED9.1(K)
FAULT_W_24V: R27.1 R145.2 U1.22
FAULT_W_INV3.3: IC17.9(3A) R159.1 U2.22
FAULT_W_INV24: IC19.9(3A) R143.1 U$8.14(4OUT)
GND_ANA: C1.1 C2.1 C3.1 C4.1 C9.2 C11.2 C12.1 C13.1 C15.2 C17.2 C19.2 C20.2 C21.2 C23.2 C24.2 C25.2 C30.2 C40.2 C56.2 C57.2 C58.2 C59.2 C60.2 C61.1 C62.1 C64.2 C66.2 C68.2 C69.2 C70.2 C71.2 C72.2 C73.2 C74.2 C75.2 C76.2 C78.2 C79.2 C80.2 C82.2 C84.2 C88.2 C90.2 C94.2 C95.1 C96.1 C97.1 C98.1 C99.1 C100.1 C101.1 C102.1 C103.1 C104.1 C105.1 C106.1 D3.1(A1) D4.1(A1) D5.1(A1) D6.1(A1) D7.1(A1) D8.1(A1) D9.1(A1) D10.1(A1) D11.1(A1) D12.1(A1) D13.1(A1) D14.1(A1) D15.1(A1) D16.1(A1) D17.1(A1) D18.1(A1) D19.1(A1) D20.1(A1) D21.1(A1) D22.1(A1) D23.1(A1) D24.1(A1) D25.1(A1) D26.1(A1) D27.1(A1) H9.B4,1(MOUNT) IC1.3(VSS) IC1.14(GND) IC2.2(GND) IC18.3(GND) IC18.4(IN4) J8.5 J12.5 J12.6 J15.6 LED3.1(K) LED4.1(K) LED5.1(K) LED6.1(K) LED12.1(K) LED13.1(K) R4.1 R10.1 R13.2 R16.1 R24.1 R29.2 R54.2 R63.2 R66.2 R67.2 R93.1 R96.1 R99.1 R101.2 R102.2 R105.2 R106.2 R112.1 R118.1 R121.1 R132.1 R133.1 R152.1 R154.2 R156.2 R171.2 R173.2 R181.1 R182.1 R183.1 U1.27 U1.30 U1.32 U1.34 U1.36 U2.27 U2.30 U2.32 U2.34 U2.36 U4.2 U4.4 U4.6 U4.12 U4.14 U4.20 U4.26 U4.32 U5.16 U5.19 U6.16 U6.19 U10.3(GND) U$9.N U$10.N U$13.P$22 U$13.P$62 U$24.1(REF-) U$24.5(REF+) U$27.1(REF-) U$27.5(REF+) U$28.1(REF-) U$28.5(REF+) U$29.1(REF-) U$29.5(REF+) U$30.1(REF-) U$30.5(REF+) U$31.1(REF-) U$31.5(REF+) VR1.1(CCW) VR2.1(CCW) VR3.1(CCW) VR4.1(CCW) VR5.1(CCW) VR6.1(CCW)
GND_DIG_HIGH: C27.2 C31.2 C42.2 C43.2 C44.2 C45.2 C46.2 C47.2 C48.2 C49.2 C50.2 C51.2 C52.2 C53.2 C54.2 C55.2 C85.2 C110.2 C111.2 C112.2 C113.2 H5.B4,1(MOUNT) IC4.4(GND) IC5.4(GND) IC6.4(GND) IC7.4(GND) IC8.4(GND) IC9.4(GND) IC10.4(GND) IC11.4(GND) IC12.4(GND) IC13.4(GND) IC14.4(GND) IC15.4(GND) IC16.4(GND) IC22.4(GND) IC24.4(GND) IC25.4(GND) IC26.4(GND) IC27.4(GND) R70.2 S14.1(NC) S15.1(NC) U1.1 U1.6 U1.11 U1.16 U1.26 U4.8 U4.18 U4.24 U4.30 U5.14 U6.14
GND_DIG_LOW: C26.2 C28.1 C29.1 C39.2 C41.2 C86.2 C91.2 C92.2 C107.2 C108.2 C109.2 IC4.3(CATHODE) IC5.3(CATHODE) IC6.3(CATHODE) IC7.3(CATHODE) IC8.3(CATHODE) IC9.3(CATHODE) IC10.3(CATHODE) IC11.3(CATHODE) IC12.3(CATHODE) IC13.3(CATHODE) IC14.3(CATHODE) IC15.3(CATHODE) IC16.3(CATHODE) IC17.7(GND) IC19.7(GND) IC20.5(LE/!STROBE) IC20.6(D_1) IC20.8(VSS) IC21.5(LE/!STROBE) IC21.8(VSS) IC22.3(CATHODE) IC23.5(GND_1) IC23.13(GND_2) IC24.3(CATHODE) IC25.3(CATHODE) IC26.3(CATHODE) IC27.3(CATHODE) IC28.2(GND) J10.6 J16.4 J17.2 LED1.1(C) LED1.6(C) LED1.7(DP) LED2.1(C) LED2.6(C) LED2.7(DP) Q3.2(S) R135.1 R138.1 R140.1 R141.1 R144.2 R146.2 R148.2 R149.2 R191.1 R195.2 R196.2 S1.B1(NO_1) S3.1(NC_1) S3.6(NO_2) S4.1(NC) S5.1(NC) S6.1(NC) S7.1(NC) S8.1(NC) S9.1(NC) S10.1(NC) S11.1(NC) S12.1(NC) U2.1 U2.6 U2.11 U2.16 U2.26 U$13.P$20 U$13.P$60
GND_POWER: 5V_VR.3(GND) 24/15_CONV.P$4(0V) 24/24_CONV.P$10(-V_OUT) C5.2(-) C6.2(-) C7.1 C22.2(-) C32.1 C33.1 C34.2 IC3.1(ADJ/GND) LED_3.3V.1(K) LED_5V.1(K) LED_24V.1(K) LED_+15V.1(K) R66.1 R67.1 R70.1 R169.2 R196.1
GND_SENSOR: 24/15_CONV_SENSOR.P$4(0V) C36.1 C37.2 SENSOR_SUPPLY.2
GND_TBA: 24/15_CONV.P$1(GND) 24/15_CONV_SENSOR.P$1(GND) 24/24_CONV.P$1(-V_IN) 24V_SUPPLY.1 C35.2(-) C38.2(-)
IL1_U_10V: R113.1 U1.31 U2.31 U4.19
IL1_U_FILTER: C17.1 R127.2 U13.3(1IN+)
IL1_U_OUT: D13.3(C1A2) D20.3(C1A2) R210.2 R217.2 U$13.P$26
IL1_U_PROTECT: C16.1 R217.1 U13.1(1OUT) U13.2(1IN-)
IL1_U_SH: R114.2 R126.1 U$15.1(1OUT)
IL1_V_10V: R64.2 U1.33 U2.33 U4.25
IL1_V_FILTER: C19.1 R129.2 U13.10(3IN+)
IL1_V_OUT: D11.3(C1A2) D21.3(C1A2) R208.2 R218.2 U$13.P$69
IL1_V_PROTECT: C18.1 R218.1 U13.8(3OUT) U13.9(3IN-)
IL1_V_SH: R62.1 R128.1 U$15.14(4OUT)
IL1_W_10V: R47.2 U1.35 U2.35 U4.31
IL1_W_FILTER: C15.1 R125.2 U13.12(4IN+)
IL1_W_OUT: D12.3(C1A2) D22.3(C1A2) R209.2 R219.2 U$13.P$66
IL1_W_PROTECT: C14.1 R219.1 U13.13(4IN-) U13.14(4OUT)
IL1_W_SH: R61.1 R124.1 U$15.8(3OUT)
IPS1_AD: R8.1 U$24.6(OUTPUT)
IPS1_FILTER: C84.1 R69.2 U$4.3(1IN+)
IPS1_N: IPS1.2 IPS1.3 IPS1.4 IPS1.5 R52.1 R60.1 U$24.2(-IN)
IPS1_OUT: D3.3(C1A2) D17.3(C1A2) R200.2 R214.2 U$13.P$25
IPS1_P: IPS1.1 R52.2 R60.2 U$24.3(+IN)
IPS1_PROTECT: C83.1 R214.1 U$4.1(1OUT) U$4.2(1IN-)
IPS1_SH: R11.2 R68.1 U$1.7(2OUT)
IPS2_AD: R5.1 U$27.6(OUTPUT)
IPS2_FILTER: C88.1 R73.2 U$4.5(2IN+)
IPS2_N: IPS2.2 IPS2.3 IPS2.4 IPS2.5 R51.1 R59.1 U$27.2(-IN)
IPS2_OUT: D5.3(C1A2) D18.3(C1A2) R202.2 R215.2 U$13.P$68
IPS2_P: IPS2.1 R51.2 R59.2 U$27.3(+IN)
IPS2_PROTECT: C87.1 R215.1 U$4.6(2IN-) U$4.7(2OUT)
IPS2_SH: R6.2 R72.1 U$1.1(1OUT)
IPS3_AD: R14.2 U$30.6(OUTPUT)
IPS3_FILTER: C78.1 R2.2 U$4.10(3IN+)
IPS3_N: IPS3.2 IPS3.3 IPS3.4 IPS3.5 R50.1 R58.1 U$30.2(-IN)
IPS3_OUT: D4.3(C1A2) D19.3(C1A2) R201.2 R216.2 U$13.P$65
IPS3_P: IPS3.1 R50.2 R58.2 U$30.3(+IN)
IPS3_PROTECT: C77.1 R216.1 U$4.8(3OUT) U$4.9(3IN-)
IPS3_SH: R1.1 R12.1 U$1.14(4OUT)
MBC_KPC: C58.1 IC1.7(S4) J8.2 R117.1
MULTIMETER+: H8.B4,1(MOUNT) IC1.8(D)
MUX_A0: IC1.1(A0) R183.2 S16.1(NO_1)
MUX_A1: IC1.16(A1) R182.2 S16.2(NO_2)
MUX_A2: IC1.15(A2) R181.2 S16.4(NO_3)
N$1: LED_+15V.2(A) R32.1
N$2: R147.1 R148.1 U$8.10(3IN+)
N$3: R4.2 R6.1 U$1.2(1IN-)
N$4: R5.2 R7.2 U$1.3(1IN+)
N$5: R16.2 R18.1 U$3.2(1IN-)
N$6: R10.2 R11.1 U$1.6(2IN-)
N$7: R8.2 R9.2 U$1.5(2IN+)
N$8: R17.2 R19.2 U$3.3(1IN+)
N$9: C77.2 R1.2 R2.1
N$10: C81.2 R3.2 R53.1
N$11: C83.2 R68.2 R69.1
N$12: LED_5V.2(A) R83.1
N$13: IC4.1(ANODE) R33.2
N$14: LED_3.3V.2(A) R84.1
N$15: C87.2 R72.2 R73.1
N$16: R20.2 R23.2 U$3.5(2IN+)
N$17: C89.2 R74.2 R75.1
N$18: IC5.1(ANODE) R34.2
N$19: C93.2 R78.2 R79.1
N$20: R12.2 R13.1 U$1.13(4IN-)
N$21: R14.1 R15.1 U$1.12(4IN+)
N$22: R24.2 R25.1 U$3.6(2IN-)
N$23: R26.2 R29.1 U$3.13(4IN-)
N$24: R30.1 R31.1 U$3.12(4IN+)
N$25: IC6.1(ANODE) R35.2
N$26: IC7.1(ANODE) R36.2
N$27: IC8.1(ANODE) R37.2
N$28: IC9.1(ANODE) R38.2
N$29: IC10.1(ANODE) R39.2
N$30: IC11.1(ANODE) R40.2
N$31: IC12.1(ANODE) R41.2
N$32: IC13.1(ANODE) R42.2
N$33: IC14.1(ANODE) R43.2
N$34: IC15.1(ANODE) R44.2
N$35: IC16.1(ANODE) R45.2
N$36: LED_24V.2(A) R46.1
N$37: 24/15_CONV.P$2(VIN) C35.1(+) FUSE1.2
N$38: 24/24_CONV.P$16(+V_IN) FUSE2.2
N$39: 24/15_CONV_SENSOR.P$2(VIN) C38.1(+) FUSE3.2
N$40: R47.1 R48.1 U$15.10(3IN+)
N$41: R54.1 R61.2 U$15.9(3IN-)
N$42: J1.2 VR1.2(WIPER)
N$43: R62.2 R63.1 U$15.13(4IN-)
N$44: R64.1 R65.1 U$15.12(4IN+)
N$50: J2.2 VR2.2(WIPER)
N$51: J4.2 VR3.2(WIPER)
N$52: R200.1 U5.15
N$53: Q3.1(G) R191.2 U$13.P$2
N$54: R190.1 U$13.P$10
N$55: R201.1 U5.17
N$56: C86.1 IC23.3(VCCIO) IC23.10(3V3OUT)
N$57: J5.2 VR4.2(WIPER)
N$58: J6.2 VR5.2(WIPER)
N$59: R100.1 R101.1 U$1.10(3IN+)
N$60: R104.1 R105.1 U$3.10(3IN+)
N$61: R106.1 R107.2 U$3.9(3IN-)
N$62: C8.2 R108.2 R109.1
N$63: R102.1 R103.2 U$1.9(3IN-)
N$64: C10.2 R110.2 R111.1
N$65: R112.2 R114.1 U$15.2(1IN-)
N$66: R113.2 R115.2 U$15.3(1IN+)
N$67: J7.2 VR6.2(WIPER)
N$68: J1.1 R91.2
N$69: R91.1 R92.2 R93.2
N$70: D2.1(K) U6.12
N$71: C14.2 R124.2 R125.1
N$72: C16.2 R126.2 R127.1
N$73: C18.2 R128.2 R129.1
N$74: J3.1 VR1.3(CW) VR2.3(CW) VR3.3(CW) VR4.3(CW) VR5.3(CW) VR6.3(CW)
N$75: R135.2 R137.1 U$8.2(1IN-)
N$76: R136.2 R138.2 U$8.3(1IN+)
N$77: R139.2 R140.2 U$8.5(2IN+)
N$78: R141.2 R142.1 U$8.6(2IN-)
N$79: R143.2 R144.1 U$8.13(4IN-)
N$80: R145.1 R146.1 U$8.12(4IN+)
N$81: IC2.4(CAP) U$10.P
N$82: R149.1 R150.2 U$8.9(3IN-)
N$83: J2.1 R94.2
N$84: R94.1 R95.2 R96.2
N$86: D1.1(K) U5.12
N$87: J4.1 R97.2
N$88: LED7.2(A) R163.1
N$89: LED8.2(A) R164.1
N$90: LED9.2(A) R165.1
N$91: LED10.2(A) R166.1
N$92: LED11.2(A) R168.1
N$93: LED_-15V.2(A) R169.1
N$94: R97.1 R98.2 R99.2
N$95: C74.1 IC2.5(OUT) J9.2 U10.2(VREF)
N$97: J5.1 R116.2
N$98: R116.1 R117.2 R118.2
N$99: R133.2 R151.1 U$2.2(1IN-)
N$100: R134.2 R152.2 U$2.3(1IN+)
N$101: R153.1 R154.1 U$2.10(3IN+)
N$102: R119.1 R120.2 R121.2
N$103: J6.1 R119.2
N$104: R156.1 R158.2 U$2.9(3IN-)
N$105: J7.1 R122.2
N$106: R122.1 R123.2 R132.2
N$107: R170.2 R171.1 U$2.13(4IN-)
N$108: R172.1 R173.1 U$2.12(4IN+)
N$109: C63.2 R174.2 R175.1
N$110: C65.2 R176.2 R177.1
N$111: C67.2 R178.2 R179.1
N$112: IC23.11(RESET#) R194.2 R195.1
N$113: LED3.2(A) R185.2
N$114: LED4.2(A) R186.2
N$115: LED5.2(A) R187.2
N$116: LED6.2(A) R188.2
N$117: IC20.15(F) LED1.2(F)
N$118: IC20.14(G) LED1.3(G)
N$119: IC20.13(A_2) LED1.10(A)
N$120: IC20.12(B_2) LED1.9(B)
N$121: IC20.11(C_2) LED1.8(C)
N$122: IC20.10(D_2) LED1.5(D)
N$123: IC20.9(E) LED1.4(E)
N$124: LED12.2(A) R189.2
N$125: IC21.15(F) LED2.2(F)
N$126: R203.1 U5.20
N$127: R202.1 U5.18
N$128: IC21.14(G) LED2.3(G)
N$129: IC21.13(A_2) LED2.10(A)
N$130: IC21.12(B_2) LED2.9(B)
N$131: IC21.11(C_2) LED2.8(C)
N$132: IC21.10(D_2) LED2.5(D)
N$133: IC21.9(E) LED2.4(E)
N$134: LED13.2(A) R190.2
N$135: IC22.1(ANODE) R184.2
N$136: C108.1 J16.2 R193.1
N$137: R185.1 U$13.P$4
N$138: R186.1 U$13.P$5
N$139: R187.1 U$13.P$6
N$140: IC23.8(USBDP) R192.2
N$141: R188.1 U$13.P$8
N$142: R189.1 U$13.P$9
N$143: C107.1 J16.3 R192.1
N$144: IC24.1(ANODE) R71.2
N$145: IC25.1(ANODE) R197.2
N$146: IC23.9(USBDM) R193.2
N$147: IC26.1(ANODE) R198.2
N$148: IC27.1(ANODE) R199.2
N$149: R204.1 U6.15
N$150: R206.1 U6.18
N$151: J16.1 R194.1
N$152: R205.1 U6.17
N$153: R207.1 U6.20
N$154: J15.3 R208.1
N$155: J15.4 R209.1
N$156: J15.5 R210.1
N$157: J17.6 R85.2
N$158: R89.2 U$13.P$7
PLL_BW: C57.1 IC1.6(S3) R98.1 U$13.P$28
POR_3.3V: IC17.11(4B) IC19.11(4B) LED11.1(K) U$13.P$13
POR_24V: R147.2 R157.1 U1.24
POR_INV3.3: IC17.12(4A) R167.1 U2.24
POR_INV24: IC19.12(4A) R150.1 U$8.8(3OUT)
PWM_3.3V_U1: R33.1 U2.2 U$13.P$40
PWM_3.3V_U2: R34.1 U2.3 U$13.P$37
PWM_3.3V_U3: R35.1 U2.4 U$13.P$39
PWM_3.3V_U4: R36.1 U2.5 U$13.P$38
PWM_3.3V_V1: R37.1 U2.7 U$13.P$36
PWM_3.3V_V2: R38.1 U2.8 U$13.P$79
PWM_3.3V_V3: R39.1 U2.9 U$13.P$35
PWM_3.3V_V4: R40.1 U2.10 U$13.P$80
PWM_3.3V_W1: R41.1 U2.12 U$13.P$78
PWM_3.3V_W2: R42.1 U2.13 U$13.P$75
PWM_3.3V_W3: R43.1 U2.14 U$13.P$77
PWM_3.3V_W4: R44.1 U2.15 U$13.P$76
PWM_24V_U1: IC4.5(VO) U1.2 U4.15 U5.2
PWM_24V_U2: IC5.5(VO) U1.3 U4.22 U5.3
PWM_24V_U3: IC6.5(VO) U1.4 U4.16 U5.4
PWM_24V_U4: IC7.5(VO) U1.5 U4.21 U5.5
PWM_24V_V1: IC8.5(VO) U1.7 U4.27 U5.6
PWM_24V_V2: IC9.5(VO) U1.8 U5.7
PWM_24V_V3: IC10.5(VO) U1.9 U4.28 U5.8
PWM_24V_V4: IC11.5(VO) U1.10 U5.9
PWM_24V_W1: IC12.5(VO) U1.12 U6.2
PWM_24V_W2: IC13.5(VO) U1.13 U6.3
PWM_24V_W3: IC14.5(VO) U1.14 U6.4
PWM_24V_W4: IC15.5(VO) U1.15 U6.5
RELAY_GRID_3.3V: R184.1 U$13.P$3
RELAY_GRID_24V: H7.B4,1(MOUNT) IC22.5(VO)
RELAY_LG_24V: H6.B4,1(MOUNT) S15.2(COM)
RT_GPIO_1_3.3V: J11.1 R71.1 U$13.P$17
RT_GPIO_1_24V: IC24.5(VO) U6.6
RT_GPIO_2_3.3V: J11.2 R197.1 U$13.P$54
RT_GPIO_2_24V: IC25.5(VO) U6.7
RT_GPIO_3_3.3V: J12.3 R198.1 U$13.P$49
RT_GPIO_3_24V: IC26.5(VO) U6.8
RT_GPIO_4_3.3V: J12.4 R199.1 U$13.P$50
RT_GPIO_4_24V: IC27.5(VO) U6.9
SPI_A_CLK: IC18.10(SCLK) R85.1 R89.1
SPI_A_S/S/: IC18.1(!CS) J17.3 U$13.P$19
SPI_A_SIMO: IC18.8(DIN) J17.4 U$13.P$15
SPI_A_SOMI: IC18.9(DOUT) J17.5 U$13.P$14
SPI_B_CLK: IC23.15(CLK) J10.3 U$13.P$53
SPI_B_S/S/: IC23.14(CS#) J10.4 U$13.P$52
SPI_B_SIMO: IC23.1(MIOSI[0]) J10.2 U$13.P$34
SPI_B_SOMI: IC23.7(MISO) J10.5 U$13.P$51
STATE_TENS0: IC20.7(A_1) U$13.P$55
STATE_TENS1: IC20.1(B_1) U$13.P$12
STATE_TENS2: IC20.2(C_1) U$13.P$11
STATE_UNITS0: IC21.7(A_1) U$13.P$57
STATE_UNITS1: IC21.1(B_1) U$13.P$58
STATE_UNITS2: IC21.2(C_1) U$13.P$59
STATE_UNITS3: IC21.6(D_1) U$13.P$33
TEMP_U_10V: R134.1 U1.37 U2.37 U4.11
TEMP_U_FILTER: C66.1 R177.2 U7.3(1IN+)
TEMP_U_OUT: D23.3(C1A2) IC18.7(IN1) R220.2
TEMP_U_PROTECT: C65.1 R220.1 U7.1(1OUT) U7.2(1IN-)
TEMP_U_SH: R151.2 R176.1 U$2.1(1OUT)
TEMP_V_10V: R172.2 U1.38 U2.38
TEMP_V_FILTER: C68.1 R179.2 U7.10(3IN+)
TEMP_V_OUT: D24.3(C1A2) IC18.6(IN2) R221.2
TEMP_V_PROTECT: C67.1 R221.1 U7.8(3OUT) U7.9(3IN-)
TEMP_V_SH: R170.1 R178.1 U$2.14(4OUT)
TEMP_W_10V: R153.2 U1.39 U2.39
TEMP_W_FILTER: C64.1 R175.2 U7.12(4IN+)
TEMP_W_OUT: D25.3(C1A2) IC18.5(IN3) R222.2
TEMP_W_PROTECT: C63.1 R222.1 U7.13(4IN-) U7.14(4OUT)
TEMP_W_SH: R158.1 R174.1 U$2.8(3OUT)
TS_ACC: S6.2(COM) U$13.P$44
TS_BW: S8.2(COM) U$13.P$46
TS_EXTRA1: S11.2(COM) U$13.P$74
TS_EXTRA2: S12.2(COM) U$13.P$73
TS_GRID: S5.2(COM) U$13.P$43
TS_KP: S7.2(COM) U$13.P$45
TS_KPC: S9.2(COM) U$13.P$47
TS_OLPLL: S4.2(COM) U$13.P$42
TS_VD: S10.2(COM) U$13.P$48
VDC_BOT_10V: R104.2 U1.29 U2.29
VDC_BOT_FILTER: C9.1 R109.2 U$6.12(4IN+)
VDC_BOT_OUT: D27.3(C1A2) J14.2 R224.2
VDC_BOT_PROTECT: C8.1 R224.1 U$6.13(4IN-) U$6.14(4OUT)
VDC_BOT_SH: R107.1 R108.1 U$3.8(3OUT)
VDC_TOP_10V: R100.2 U1.28 U2.28 U4.13
VDC_TOP_FILTER: C11.1 R111.2 U$4.12(4IN+)
VDC_TOP_OUT: D26.3(C1A2) J13.2 R223.2
VDC_TOP_PROTECT: C10.1 R223.1 U$4.13(4IN-) U$4.14(4OUT)
VDC_TOP_SH: R103.1 R110.1 U$1.8(3OUT)
VDC_VD: C59.1 IC1.12(S5) J8.3 R120.1
VPS1_AD: R20.1 U$28.6(OUTPUT)
VPS1_FILTER: C94.1 R79.2 U$6.3(1IN+)
VPS1_N: R49.1 R57.1 U$28.2(-IN) VPS1.2 VPS1.3 VPS1.4 VPS1.5
VPS1_OUT: D6.3(C1A2) D14.3(C1A2) R203.2 R211.2 U$13.P$24
VPS1_P: R49.2 R57.2 U$28.3(+IN) VPS1.1
VPS1_PROTECT: C93.1 R211.1 U$6.1(1OUT) U$6.2(1IN-)
VPS1_SH: R25.2 R78.1 U$3.7(2OUT)
VPS2_AD: R17.1 U$29.6(OUTPUT)
VPS2_FILTER: C90.1 R75.2 U$6.5(2IN+)
VPS2_N: R22.1 R56.1 U$29.2(-IN) VPS2.2 VPS2.3 VPS2.4 VPS2.5
VPS2_OUT: D7.3(C1A2) D15.3(C1A2) R204.2 R212.2 U$13.P$67
VPS2_P: R22.2 R56.2 U$29.3(+IN) VPS2.1
VPS2_PROTECT: C89.1 R212.1 U$6.6(2IN-) U$6.7(2OUT)
VPS2_SH: R18.2 R74.1 U$3.1(1OUT)
VPS3_AD: R30.2 U$31.6(OUTPUT)
VPS3_FILTER: C82.1 R53.2 U$6.10(3IN+)
VPS3_N: R21.1 R55.1 U$31.2(-IN) VPS3.2 VPS3.3 VPS3.4 VPS3.5
VPS3_OUT: D9.3(C1A2) D16.3(C1A2) R206.2 R213.2 U$13.P$64
VPS3_P: R21.2 R55.2 U$31.3(+IN) VPS3.1
VPS3_PROTECT: C81.1 R213.1 U$6.8(3OUT) U$6.9(3IN-)
VPS3_SH: R3.1 R26.1 U$3.14(4OUT)
Unconnected: 5V_VR.4(N.C.) 24/15_CONV.P$6(CTRL) 24/15_CONV_SENSOR.P$6(CTRL) IC1.9(S8) IC1.10(S7) IC4.2(NC) IC5.2(NC) IC6.2(NC) IC7.2(NC) IC8.2(NC) IC9.2(NC) IC10.2(NC) IC11.2(NC) IC12.2(NC) IC13.2(NC) IC14.2(NC) IC15.2(NC) IC16.2(NC) IC22.2(NC) IC23.2(MIOSI[2]) IC23.4(MIOSI[1]) IC23.6(MIOSI[3]) IC23.16(CBUS3) IC24.2(NC) IC25.2(NC) IC26.2(NC) IC27.2(NC) J16.MH1 J16.MH2 S1.A2(COM_2) S1.B2(NO_2) S2.1(NC_1) S2.6(NO_2) S16.8(NO_4) U1.17 U1.18 U1.19 U1.40 U2.17 U2.18 U2.19 U2.40 U4.7 U4.10 U4.17 U4.23 U4.29 U4.33 U4.34 U5.1 U5.10 U5.11 U5.13 U6.1 U6.10 U6.11 U6.13 U7.5(2IN+) U7.6(2IN-) U7.7(2OUT) U13.5(2IN+) U13.6(2IN-) U13.7(2OUT) U$2.5(2IN+) U$2.6(2IN-) U$2.7(2OUT) U$13.P$16 U$13.P$23 U$13.P$29 U$13.P$31 U$13.P$32 U$13.P$56 U$13.P$63 U$13.P$71 U$13.P$72 U$15.5(2IN+) U$15.6(2IN-) U$15.7(2OUT) U$24.8(NC) U$27.8(NC) U$28.8(NC) U$29.8(NC) U$30.8(NC) U$31.8(NC) VR1.MH1 VR1.MH2 VR2.MH1 VR2.MH2 VR3.MH1 VR3.MH2 VR4.MH1 VR4.MH2 VR5.MH1 VR5.MH2 VR6.MH1 VR6.MH2

## Notes on the sheet
- Power
- Power Supply & Voltage regulator
- POTI for parameter adjusting
- Connect to ADC-D (J21)
- Analog
- Main board <--> Sensor board
- ANALOG FILTERING (fr=40kHz)
- LEM Sensor Signal to Voltage (+-5V)
- Voltage Shifter 
  for sensed signals
  -5V~+5V --> 0~3V
- current signals | current signals
- temperature signals | voltage signals
- Send voltage supply to sensor board
- ISL21010CFH315ZT is used on PCB
  this device is only a reference for symbol&footprint
- Digital
- Launchpad 28379 | Voltage Shifter 3.3V -> 24V | Signal Output
- Select fault signals 3.3V/24V | 3-L inverter 3.3V
- Pull-up resistor
- Should be 200MDP3T1B1M2QEH
- 3-L inverter 24V
- Pull-up resistors
- Pull-up resistors
- Select 24V or 3.3V fault signals
- 3.3V fault signals
- Give clear_fault signal
  Button should be open 
  during normal operation
- 24V fault signals
- Select voltage level of 
  launchpad power source
- Protection for ADC input pins of LP
- Should be 200MDP3T1B1M2QEH
- Fault indicator
- RT box
- 2-L inverter 24V
- 2L_PWM_24V_V_TOP
- 2L_PWM_24V_V_BOT
- ALL red LED must be turned off during
  operation
- 2L_PWM_24V_W_TOP
- 2L_PWM_24V_W_BOT
- From RTBOX,range: 0~3.3V | VDC_BOT_OUT
- 2L_PWM_24V_U_TOP
- 2L_PWM_24V_U_BOT
- From RTBOX,range: 0~3.3V | VDC_TOP_OUT
- Switches for Enable signals
- Voltage Shifter 24V -> 3.3V
- current signals